# EAGLE design econotag (EAGLE 4.16)

## Sheet 1 of 3
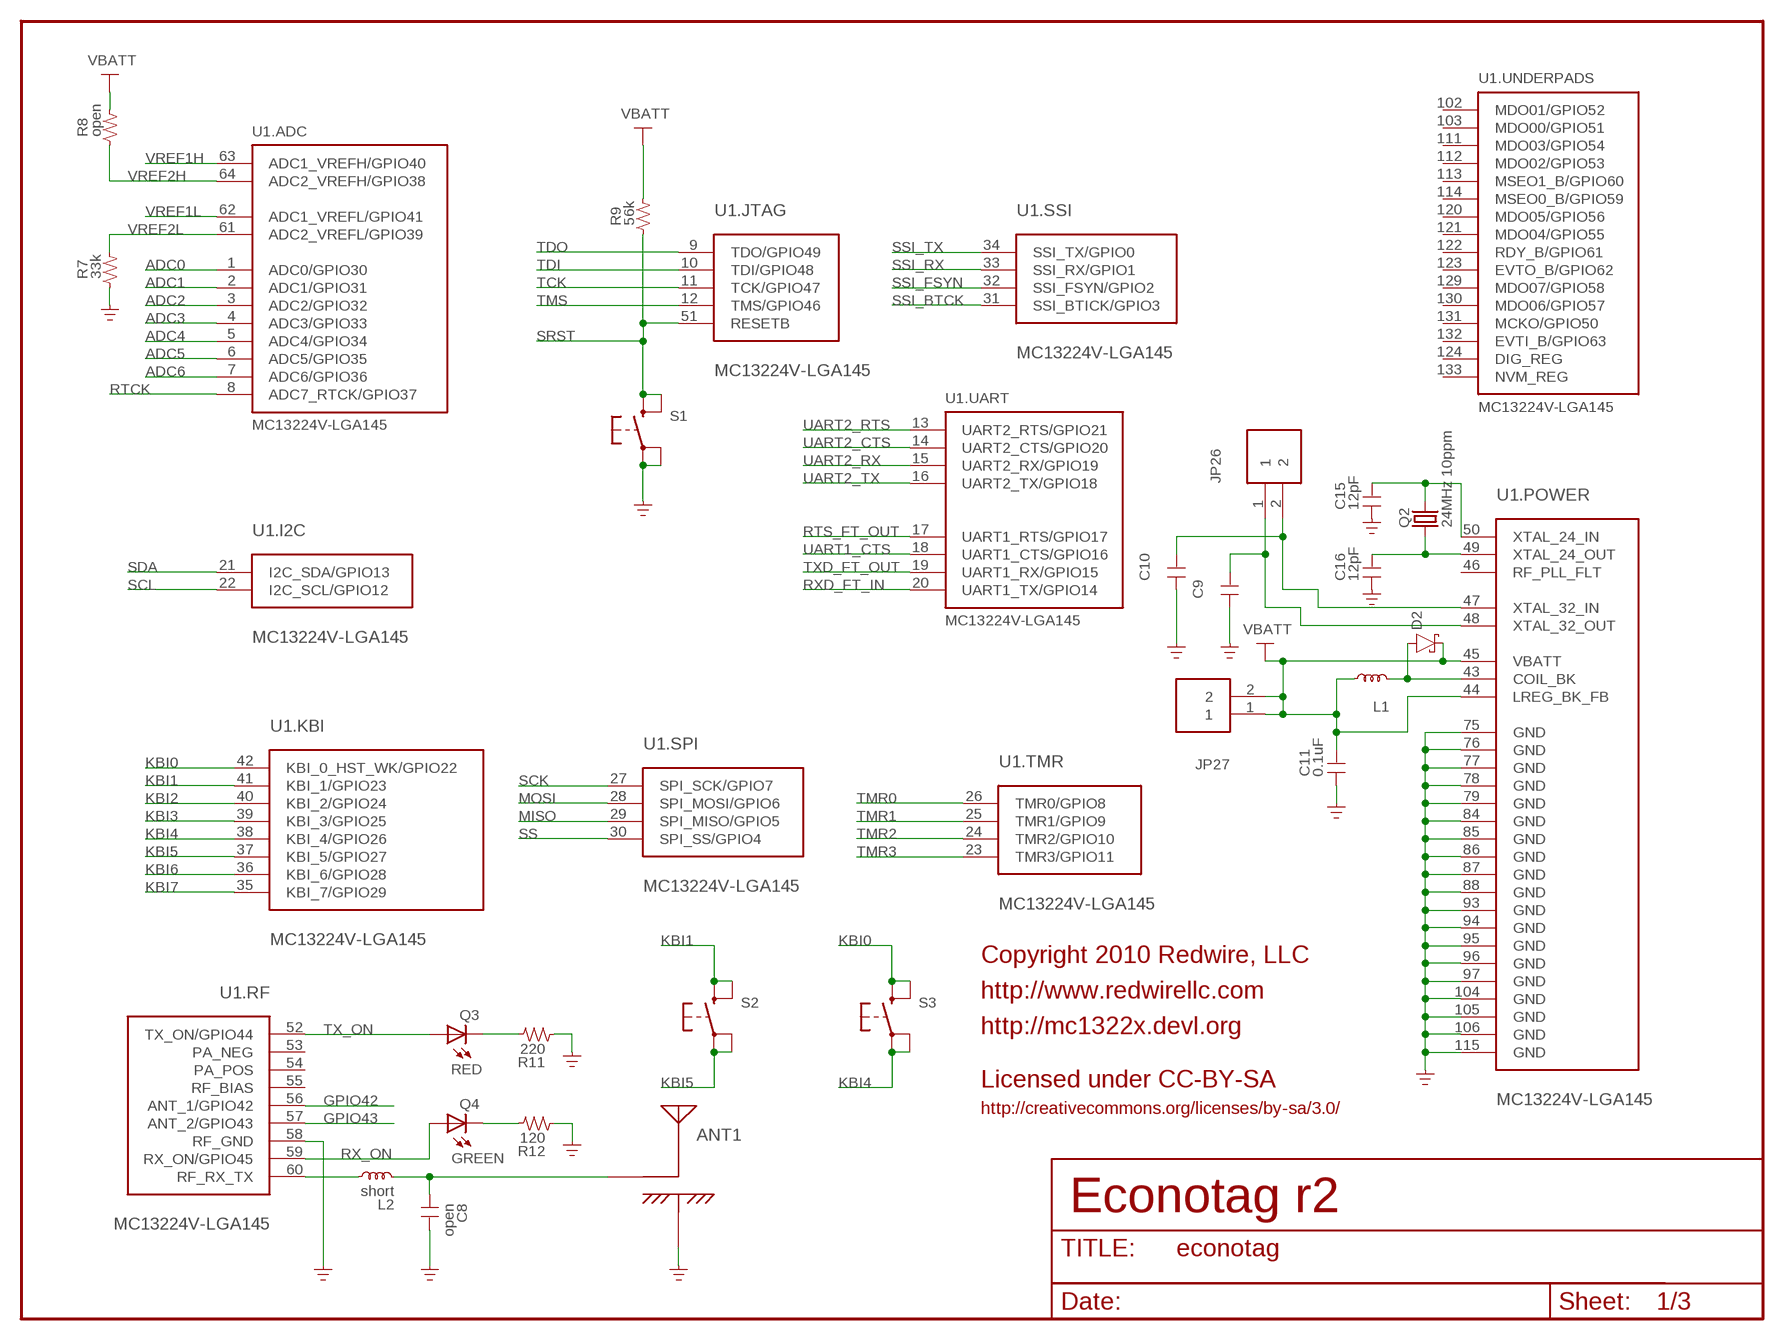
[diagram p0: schematic, sheet 1]

### Parts
ANT1  ANT-2CON  [ANT-INV-F]
C8  open  C-0603  [SMD0603]
C9  C-0603  [SMD0603]
C10  C-0603  [SMD0603]
C11  0.1uF  C-0603  [SMD0603]
C15  12pF  C-0603  [SMD0603]
C16  12pF  C-0603  [SMD0603]
D2  D-SCHOTTKY-SOD123  [SOD123]
JP26  CONN-2  [1X2]
JP27  CONN-2  [1X2]
L1  L-SLF6028  [SLF6028]
L2  short  L-0603  [SMD0603]
Q2  24MHz 10ppm  CRYSTAL  [SM49]
Q3  RED  LED-0603  [LED0603]
Q4  GREEN  LED-0603  [LED0603]
R7  33k  R-0603  [SMD0603]
R8  open  R-0603  [SMD0603]
R9  56k  R-0603  [SMD0603]
R11  220  R-0603  [SMD0603]
R12  120  R-0603  [SMD0603]
S1  SPST-MOM-KSCJ  [KSC-J]
S2  SPST-MOM-KSCJ  [KSC-J]
S3  SPST-MOM-KSCJ  [KSC-J]
U1  MC13224V-LGA145  [LGA145]

### Nets
3V3: C11.2 D2.C JP27.1 JP27.2 L1.1 R8.2 R9.2 U1.44(.POWER:LREG_BK_FB) U1.45(.POWER:VBATT) ; supply symbol labelled VBATT ; also sheet 2,3
ADC0: U1.1(.ADC:ADC0/GPIO30) ; also sheet 3
ADC1: U1.2(.ADC:ADC1/GPIO31) ; also sheet 3
ADC2: U1.3(.ADC:ADC2/GPIO32) ; also sheet 3
ADC3: U1.4(.ADC:ADC3/GPIO33) ; also sheet 3
ADC4: U1.5(.ADC:ADC4/GPIO34) ; also sheet 3
ADC5: U1.6(.ADC:ADC5/GPIO35) ; also sheet 3
ADC6: U1.7(.ADC:ADC6/GPIO36) ; also sheet 3
GND: ANT1.GND C8.2 C9.1 C10.1 C11.1 C15.1 C16.1 R7.1 R11.1 R12.1 S1.A1(P) S1.A2(P1) U1.58(.RF:RF_GND) U1.75(.POWER:GND) U1.76(.POWER:GND) U1.77(.POWER:GND) U1.78(.POWER:GND) U1.79(.POWER:GND) U1.84(.POWER:GND) U1.85(.POWER:GND) U1.86(.POWER:GND) U1.87(.POWER:GND) U1.88(.POWER:GND) U1.93(.POWER:GND) U1.94(.POWER:GND) U1.95(.POWER:GND) U1.96(.POWER:GND) U1.97(.POWER:GND) U1.104(.POWER:GND) U1.105(.POWER:GND) U1.106(.POWER:GND) U1.115(.POWER:GND) ; also sheet 2,3
GPIO42: U1.56(.RF:ANT_1/GPIO42) ; also sheet 3
GPIO43: U1.57(.RF:ANT_2/GPIO43) ; also sheet 3
KBI0: S3.B1(S) S3.B2(S1) U1.42(.KBI:KBI_0_HST_WK/GPIO22)
KBI1: S2.B1(S) S2.B2(S1) U1.41(.KBI:KBI_1/GPIO23)
KBI2: U1.40(.KBI:KBI_2/GPIO24) ; also sheet 3
KBI3: U1.39(.KBI:KBI_3/GPIO25) ; also sheet 3
KBI4: S3.A1(P) S3.A2(P1) U1.38(.KBI:KBI_4/GPIO26)
KBI5: S2.A1(P) S2.A2(P1) U1.37(.KBI:KBI_5/GPIO27)
KBI6: U1.36(.KBI:KBI_6/GPIO28) ; also sheet 3
KBI7: U1.35(.KBI:KBI_7/GPIO29) ; also sheet 3
MISO: U1.29(.SPI:SPI_MISO/GPIO5) ; also sheet 3
MOSI: U1.28(.SPI:SPI_MOSI/GPIO6) ; also sheet 3
N$11: Q4.C R12.2
N$12: L2.1 U1.60(.RF:RF_RX_TX)
N$13: C16.2 Q2.1 U1.49(.POWER:XTAL_24_OUT)
N$14: C15.2 Q2.2 U1.50(.POWER:XTAL_24_IN)
N$15: ANT1.FEED C8.1 L2.2
N$16: C9.2 JP26.1 U1.48(.POWER:XTAL_32_OUT)
N$17: C10.2 JP26.2 U1.47(.POWER:XTAL_32_IN)
N$19: D2.A L1.2 U1.43(.POWER:COIL_BK)
N$20: Q3.C R11.2
RTCK: U1.8(.ADC:ADC7_RTCK/GPIO37) ; also sheet 2
RTS_FT_OUT: U1.17(.UART:UART1_RTS/GPIO17) ; also sheet 2
RX_ON: Q4.A U1.59(.RF:RX_ON/GPIO45) ; also sheet 3
RXD_FT_IN: U1.20(.UART:UART1_TX/GPIO14) ; also sheet 2
SCK: U1.27(.SPI:SPI_SCK/GPIO7) ; also sheet 3
SCL: U1.22(.I2C:I2C_SCL/GPIO12) ; also sheet 3
SDA: U1.21(.I2C:I2C_SDA/GPIO13) ; also sheet 3
SRST: R9.1 S1.B1(S) S1.B2(S1) U1.51(.JTAG:RESETB) ; also sheet 2
SS: U1.30(.SPI:SPI_SS/GPIO4) ; also sheet 3
SSI_BTCK: U1.31(.SSI:SSI_BTICK/GPIO3) ; also sheet 3
SSI_FSYN: U1.32(.SSI:SSI_FSYN/GPIO2) ; also sheet 3
SSI_RX: U1.33(.SSI:SSI_RX/GPIO1) ; also sheet 3
SSI_TX: U1.34(.SSI:SSI_TX/GPIO0) ; also sheet 3
TCK: U1.11(.JTAG:TCK/GPIO47) ; also sheet 2
TDI: U1.10(.JTAG:TDI/GPIO48) ; also sheet 2
TDO: U1.9(.JTAG:TDO/GPIO49) ; also sheet 2
TMR0: U1.26(.TMR:TMR0/GPIO8) ; also sheet 3
TMR1: U1.25(.TMR:TMR1/GPIO9) ; also sheet 3
TMR2: U1.24(.TMR:TMR2/GPIO10) ; also sheet 3
TMR3: U1.23(.TMR:TMR3/GPIO11) ; also sheet 3
TMS: U1.12(.JTAG:TMS/GPIO46) ; also sheet 2
TX_ON: Q3.A U1.52(.RF:TX_ON/GPIO44) ; also sheet 3
TXD_FT_OUT: U1.19(.UART:UART1_RX/GPIO15) ; also sheet 2
UART1_CTS: U1.18(.UART:UART1_CTS/GPIO16) ; also sheet 2,3
UART2_CTS: U1.14(.UART:UART2_CTS/GPIO20) ; also sheet 3
UART2_RTS: U1.13(.UART:UART2_RTS/GPIO21) ; also sheet 3
UART2_RX: U1.15(.UART:UART2_RX/GPIO19) ; also sheet 3
UART2_TX: U1.16(.UART:UART2_TX/GPIO18) ; also sheet 3
VREF1H: U1.63(.ADC:ADC1_VREFH/GPIO40) ; also sheet 3
VREF1L: U1.62(.ADC:ADC1_VREFL/GPIO41) ; also sheet 3
VREF2H: R8.1 U1.64(.ADC:ADC2_VREFH/GPIO38) ; also sheet 2
VREF2L: R7.2 U1.61(.ADC:ADC2_VREFL/GPIO39) ; also sheet 2
Unconnected: U1.46(.POWER:RF_PLL_FLT) U1.53(.RF:PA_NEG) U1.54(.RF:PA_POS) U1.55(.RF:RF_BIAS) U1.102(.UNDERPADS:MDO01/GPIO52) U1.103(.UNDERPADS:MDO00/GPIO51) U1.111(.UNDERPADS:MDO03/GPIO54) U1.112(.UNDERPADS:MDO02/GPIO53) U1.113(.UNDERPADS:MSEO1_B/GPIO60) U1.114(.UNDERPADS:MSEO0_B/GPIO59) U1.120(.UNDERPADS:MDO05/GPIO56) U1.121(.UNDERPADS:MDO04/GPIO55) U1.122(.UNDERPADS:RDY_B/GPIO61) U1.123(.UNDERPADS:EVTO_B/GPIO62) U1.124(.UNDERPADS:DIG_REG) U1.129(.UNDERPADS:MDO07/GPIO58) U1.130(.UNDERPADS:MDO06/GPIO57) U1.131(.UNDERPADS:MCKO/GPIO50) U1.132(.UNDERPADS:EVTI_B/GPIO63) U1.133(.UNDERPADS:NVM_REG)

### Notes on the sheet
- Copyright 2010 Redwire, LLC
- http://www.redwirellc.com
- http://mc1322x.devl.org
- Licensed under CC-BY-SA
- http://creativecommons.org/licenses/by-sa/3.0/
- Econotag r2

## Sheet 2 of 3
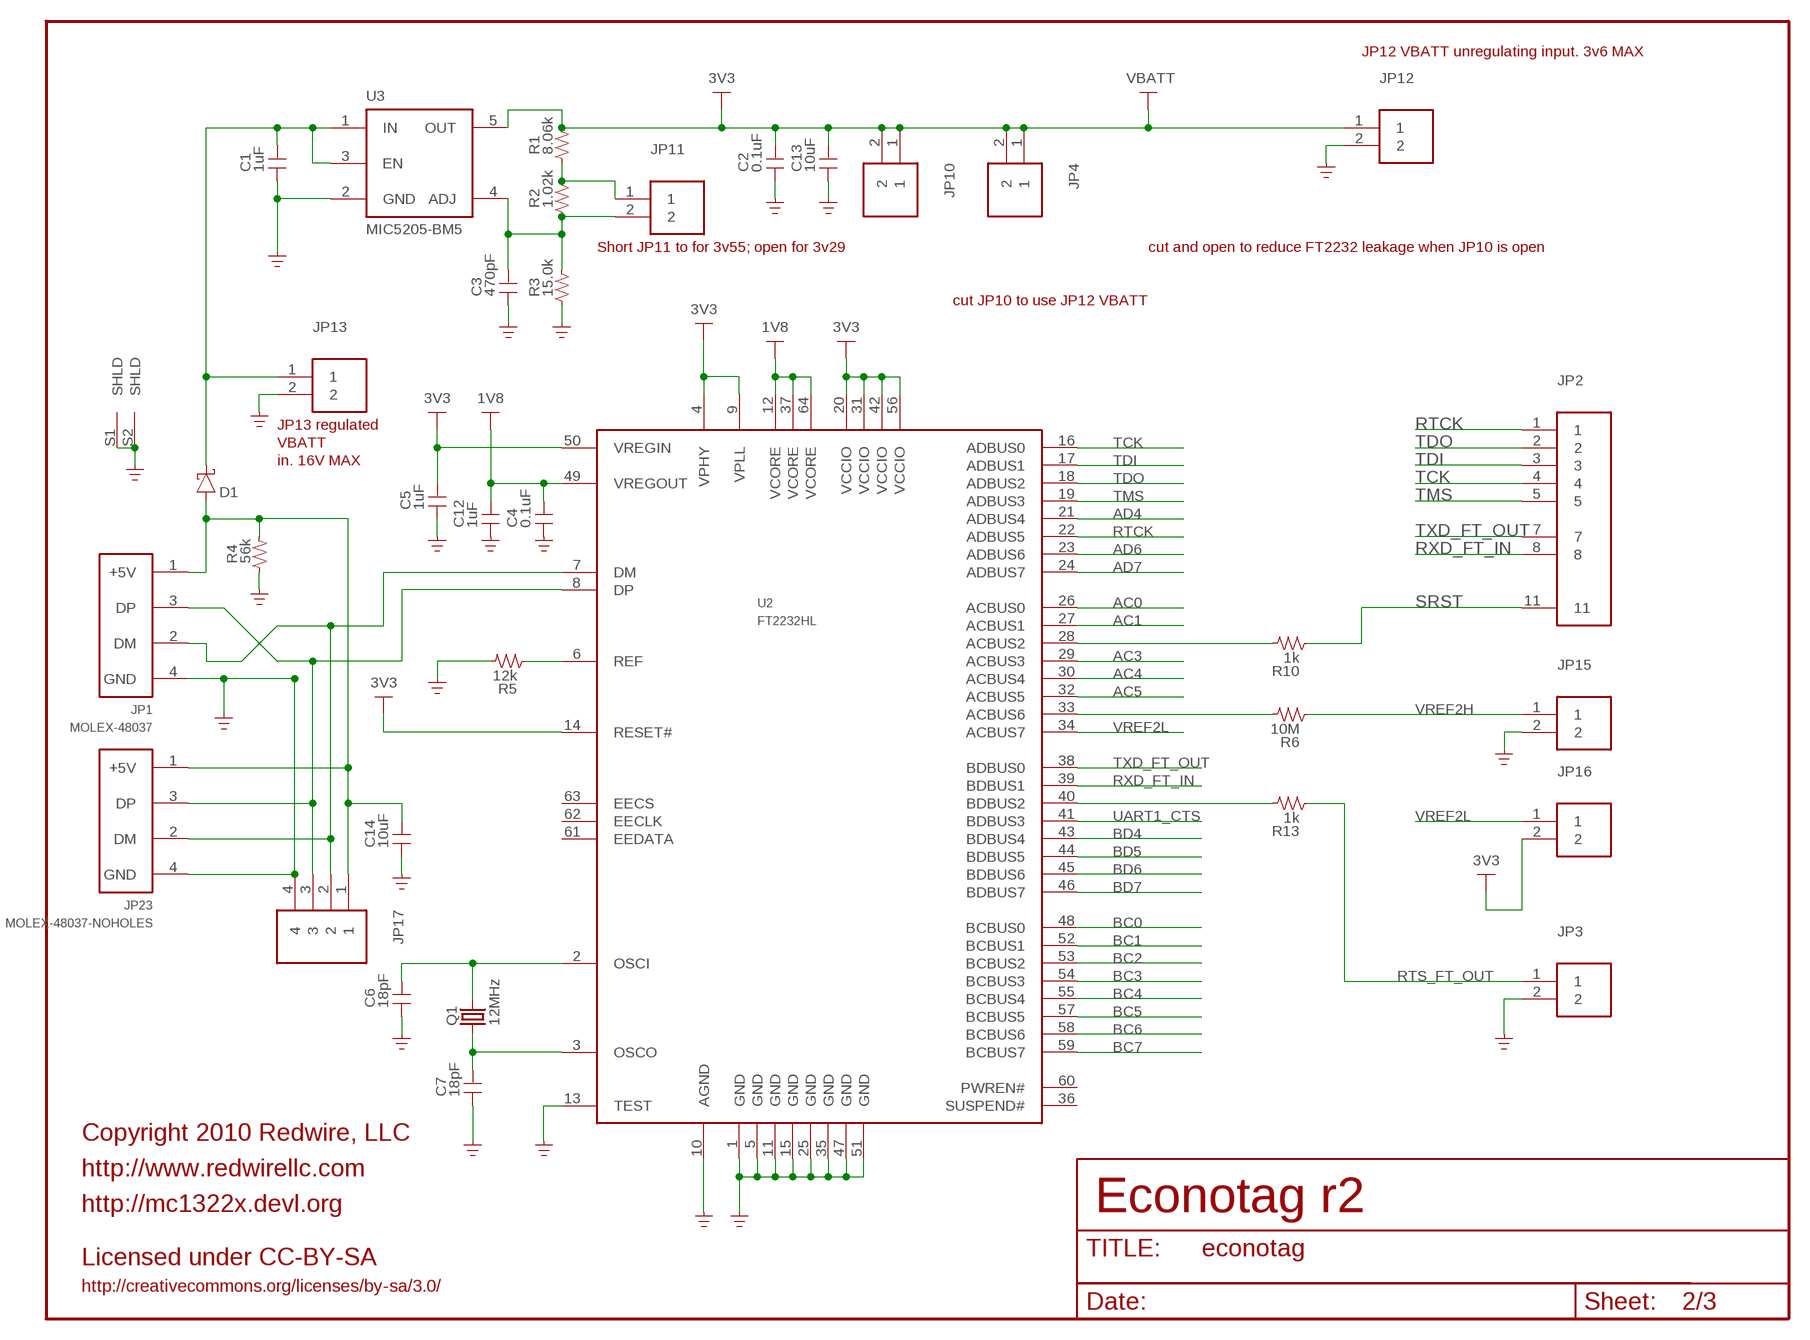
[diagram p1: schematic, sheet 2]

### Parts
C1  1uF  C-0603  [SMD0603]
C2  0.1uF  C-0603  [SMD0603]
C3  470pF  C-0603  [SMD0603]
C4  0.1uF  C-0603  [SMD0603]
C5  1uF  C-0603  [SMD0603]
C6  18pF  C-0603  [SMD0603]
C7  18pF  C-0603  [SMD0603]
C12  1uF  C-0603  [SMD0603]
C13  10uF  C-0805  [SMD0805]
C14  10uF  C-0805  [SMD0805]
D1  D-SCHOTTKY-SOD123  [SOD123]
JP1  MOLEX-48037  [USB-A-PLUG]
JP2  CONN-11  [1X11-SKIP6-9-10]
JP3  CONN-2  [1X2]
JP4  CONN-2  [1X2]
JP10  CONN-2  [1X2]
JP11  CONN-2  [1X2]
JP12  CONN-2  [1X2]
JP13  CONN-2  [1X2]
JP15  CONN-2  [1X2]
JP16  CONN-2  [1X2]
JP17  CONN-4  [1X4]
JP23  MOLEX-48037-NOHOLES  [USB-A-PLUG-NOHOLES]
Q1  12MHz  CRYSTAL  [SM49]
R1  8.06k  R-0603  [SMD0603]
R2  1.02k  R-0603  [SMD0603]
R3  15.0k  R-0603  [SMD0603]
R4  56k  R-0603  [SMD0603]
R5  12k  R-0603  [SMD0603]
R6  10M  R-0603  [SMD0603]
R10  1k  R-0603  [SMD0603]
R13  1k  R-0603  [SMD0603]
U2  FT2232HL  [LQFP-64]
U3  MIC5205-BM5  [SOT-23-5]

### Nets
1V8: C4.2 C12.2 U2.12(VCORE) U2.37(VCORE) U2.49(VREGOUT) U2.64(VCORE)
3V3: C2.2 C5.2 C13.2 JP4.1 JP4.2 JP10.1 JP10.2 JP12.1 JP16.2 R1.2 U2.4(VPHY) U2.9(VPLL) U2.14(RESET#) U2.20(VCCIO) U2.31(VCCIO) U2.42(VCCIO) U2.50(VREGIN) U2.56(VCCIO) U3.5(OUT) ; supply symbol labelled VBATT ; also sheet 1,3
+5V: C14.2 D1.A JP1.1(+5V) JP17.1 JP23.1(+5V) R4.2
AC0: U2.26(ACBUS0)
AC1: U2.27(ACBUS1)
AC3: U2.29(ACBUS3)
AC4: U2.30(ACBUS4)
AC5: U2.32(ACBUS5)
AD4: U2.21(ADBUS4)
AD6: U2.23(ADBUS6)
AD7: U2.24(ADBUS7)
BC0: U2.48(BCBUS0)
BC1: U2.52(BCBUS1)
BC2: U2.53(BCBUS2)
BC3: U2.54(BCBUS3)
BC4: U2.55(BCBUS4)
BC5: U2.57(BCBUS5)
BC6: U2.58(BCBUS6)
BC7: U2.59(BCBUS7)
BD4: U2.43(BDBUS4)
BD5: U2.44(BDBUS5)
BD6: U2.45(BDBUS6)
BD7: U2.46(BDBUS7)
GND: C1.1 C2.1 C3.1 C4.1 C5.1 C6.1 C7.1 C12.1 C13.1 C14.1 JP1.4(GND) JP1.S1(SHLD) JP1.S2(SHLD) JP3.2 JP12.2 JP13.2 JP15.2 JP17.4 JP23.4(GND) R3.1 R4.1 R5.2 U2.1(GND) U2.5(GND) U2.10(AGND) U2.11(GND) U2.13(TEST) U2.15(GND) U2.25(GND) U2.35(GND) U2.47(GND) U2.51(GND) U3.2(GND) ; also sheet 1,3
N$1: C1.2 D1.C JP13.1 U3.1(IN) U3.3(EN)
N$2: JP11.1 R1.1 R2.2
N$3: C3.2 JP11.2 R2.1 R3.2 U3.4(ADJ)
N$4: R5.1 U2.6(REF)
N$5: C6.2 Q1.2 U2.2(OSCI)
N$6: R6.2 U2.33(ACBUS6)
N$7: C7.2 Q1.1 U2.3(OSCO)
N$8: JP1.3(DP) JP17.3 JP23.3(DP) U2.8(DP)
N$9: JP1.2(DM) JP17.2 JP23.2(DM) U2.7(DM)
N$10: R10.2 U2.28(ACBUS2)
N$18: R13.2 U2.40(BDBUS2)
RTCK: JP2.1 U2.22(ADBUS5) ; also sheet 1
RTS_FT_OUT: JP3.1 R13.1 ; also sheet 1
RXD_FT_IN: JP2.8 U2.39(BDBUS1) ; also sheet 1
SRST: JP2.11 R10.1 ; also sheet 1
TCK: JP2.4 U2.16(ADBUS0) ; also sheet 1
TDI: JP2.3 U2.17(ADBUS1) ; also sheet 1
TDO: JP2.2 U2.18(ADBUS2) ; also sheet 1
TMS: JP2.5 U2.19(ADBUS3) ; also sheet 1
TXD_FT_OUT: JP2.7 U2.38(BDBUS0) ; also sheet 1
UART1_CTS: U2.41(BDBUS3) ; also sheet 1,3
VREF2H: JP15.1 R6.1 ; also sheet 1
VREF2L: JP16.1 U2.34(ACBUS7) ; also sheet 1
Unconnected: U2.36(SUSPEND#) U2.60(PWREN#) U2.61(EEDATA) U2.62(EECLK) U2.63(EECS)

### Notes on the sheet
- JP12 VBATT unregulating input. 3v6 MAX
- Short JP11 to for 3v55; open for 3v29 | cut and open to reduce FT2232 leakage when JP10 is open
- cut JP10 to use JP12 VBATT
- JP13 regulated
- VBATT
- in. 16V MAX
- Copyright 2010 Redwire, LLC
- http://www.redwirellc.com
- http://mc1322x.devl.org | Econotag r2
- Licensed under CC-BY-SA
- http://creativecommons.org/licenses/by-sa/3.0/

## Sheet 3 of 3
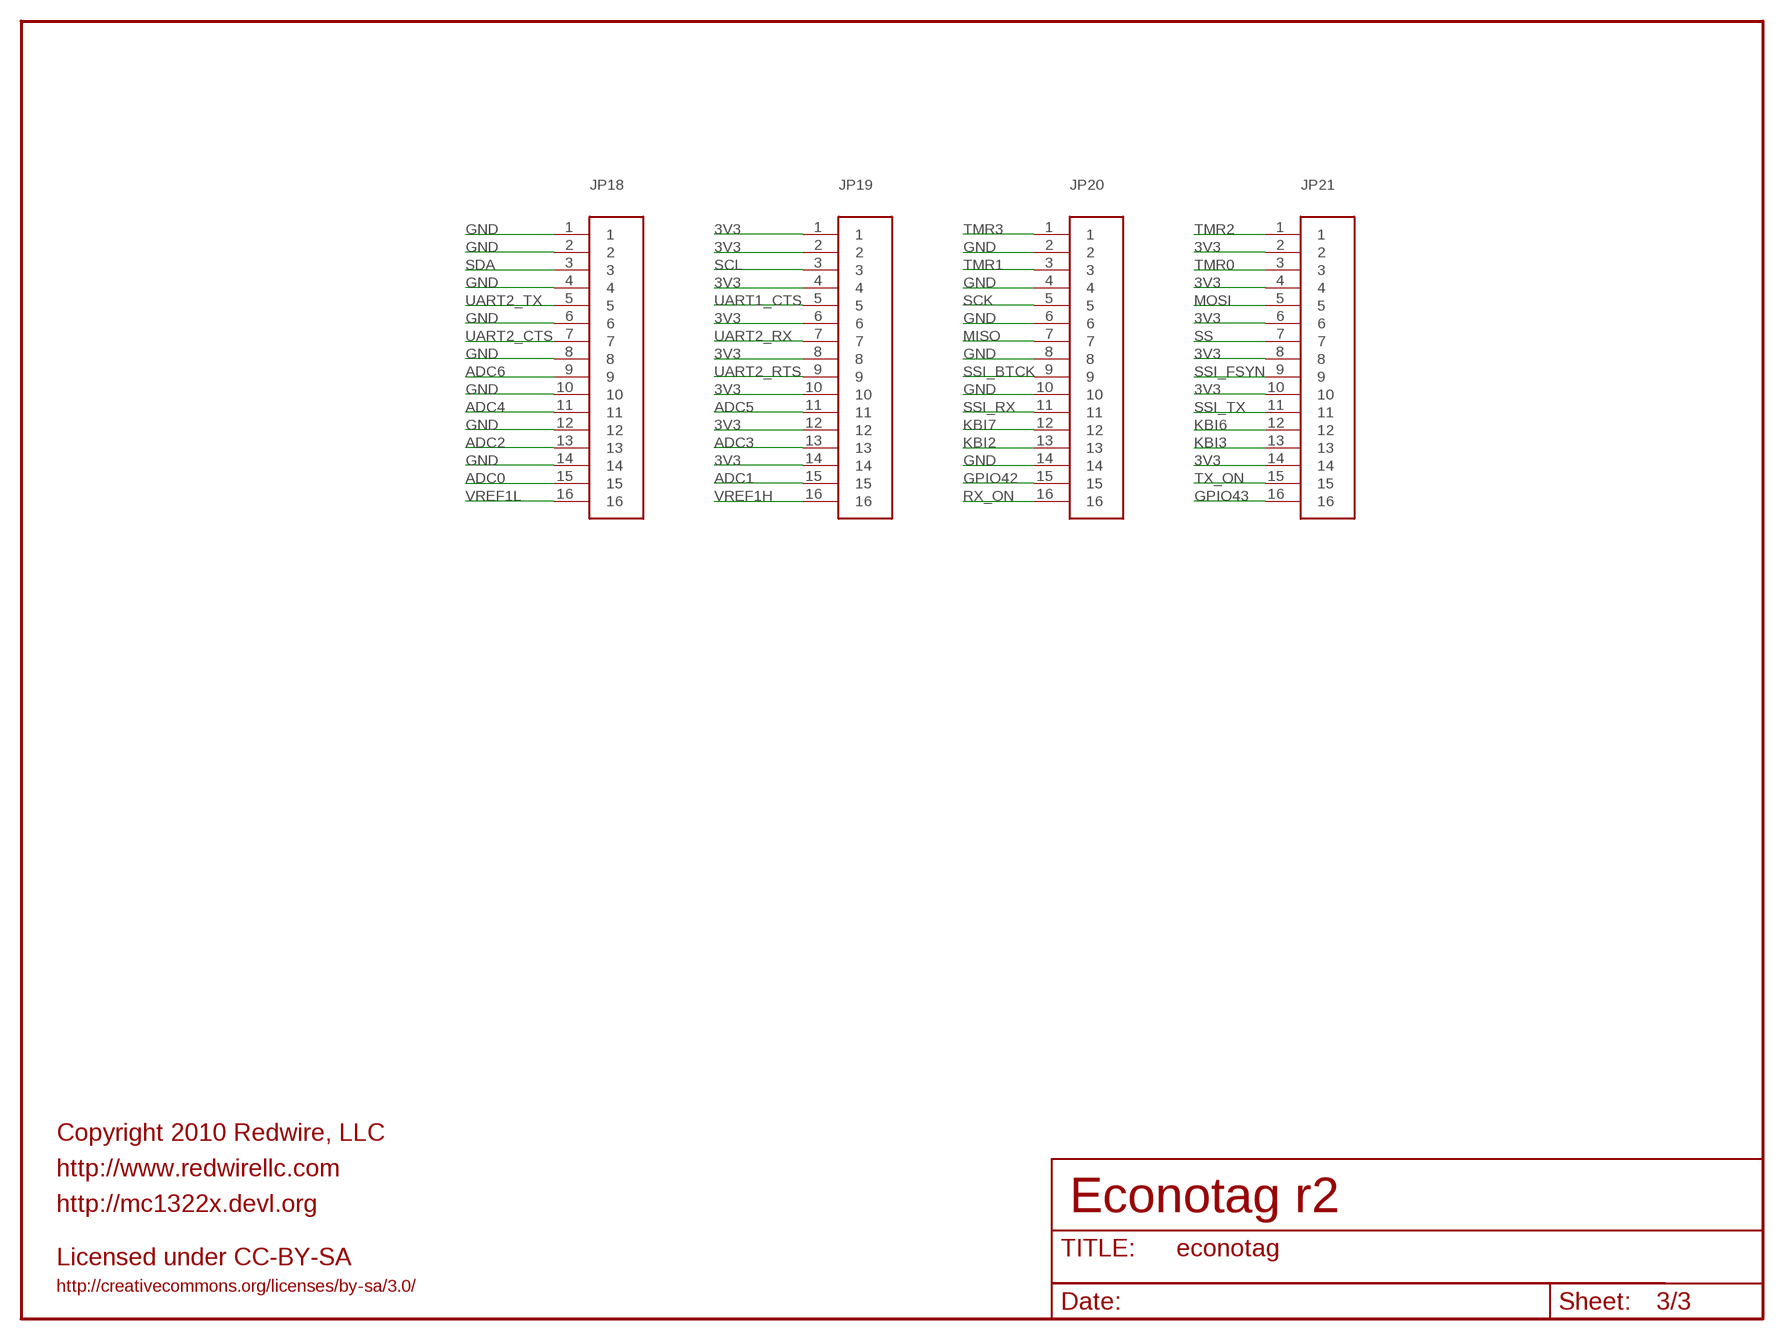
[diagram p2: schematic, sheet 3]

### Parts
JP18  CONN-16  [1X16]
JP19  CONN-16  [1X16]
JP20  CONN-16  [1X16]
JP21  CONN-16  [1X16]

### Nets
3V3: JP19.1 JP19.2 JP19.4 JP19.6 JP19.8 JP19.10 JP19.12 JP19.14 JP21.2 JP21.4 JP21.6 JP21.8 JP21.10 JP21.14 ; also sheet 1,2
ADC0: JP18.15 ; also sheet 1
ADC1: JP19.15 ; also sheet 1
ADC2: JP18.13 ; also sheet 1
ADC3: JP19.13 ; also sheet 1
ADC4: JP18.11 ; also sheet 1
ADC5: JP19.11 ; also sheet 1
ADC6: JP18.9 ; also sheet 1
GND: JP18.1 JP18.2 JP18.4 JP18.6 JP18.8 JP18.10 JP18.12 JP18.14 JP20.2 JP20.4 JP20.6 JP20.8 JP20.10 JP20.14 ; also sheet 1,2
GPIO42: JP20.15 ; also sheet 1
GPIO43: JP21.16 ; also sheet 1
KBI2: JP20.13 ; also sheet 1
KBI3: JP21.13 ; also sheet 1
KBI6: JP21.12 ; also sheet 1
KBI7: JP20.12 ; also sheet 1
MISO: JP20.7 ; also sheet 1
MOSI: JP21.5 ; also sheet 1
RX_ON: JP20.16 ; also sheet 1
SCK: JP20.5 ; also sheet 1
SCL: JP19.3 ; also sheet 1
SDA: JP18.3 ; also sheet 1
SS: JP21.7 ; also sheet 1
SSI_BTCK: JP20.9 ; also sheet 1
SSI_FSYN: JP21.9 ; also sheet 1
SSI_RX: JP20.11 ; also sheet 1
SSI_TX: JP21.11 ; also sheet 1
TMR0: JP21.3 ; also sheet 1
TMR1: JP20.3 ; also sheet 1
TMR2: JP21.1 ; also sheet 1
TMR3: JP20.1 ; also sheet 1
TX_ON: JP21.15 ; also sheet 1
UART1_CTS: JP19.5 ; also sheet 1,2
UART2_CTS: JP18.7 ; also sheet 1
UART2_RTS: JP19.9 ; also sheet 1
UART2_RX: JP19.7 ; also sheet 1
UART2_TX: JP18.5 ; also sheet 1
VREF1H: JP19.16 ; also sheet 1
VREF1L: JP18.16 ; also sheet 1

### Notes on the sheet
- Copyright 2010 Redwire, LLC
- http://www.redwirellc.com
- http://mc1322x.devl.org | Econotag r2
- Licensed under CC-BY-SA
- http://creativecommons.org/licenses/by-sa/3.0/

## Library data of the parts
ANT1 = parts:ANT-2CON
C1-C16 = parts:C
D1 D2 = parts:D-SCHOTTKY
JP1 = parts:MOLEX-48037
JP2 = parts:CONN-11
JP3 JP4 JP10-JP13 JP15 JP16 JP26 JP27 = parts:CONN-2
JP17 = parts:CONN-4
JP18-JP21 = parts:CONN-16
JP23 = parts:MOLEX-48037-NOHOLES
L1 L2 = parts:L: TDK SLF6028 Series From mouser: 810-SLF6028T-101M, 100uH, .42A, $2.73 From digikey: 445-1990-1-ND, 100uH, .42A, $2.73
Q1 Q2 = parts:CRYSTAL: 12MHz 5032 Digikey = 535-9100-1-ND
Q3 Q4 = parts:LED
R1-R13 = parts:R
S1-S3 = parts:SPST-MOM: Tact. Switch
U1 = parts:MC1322*
U2 = parts:FT2232H
U3 = parts:MIC5205*

## Board
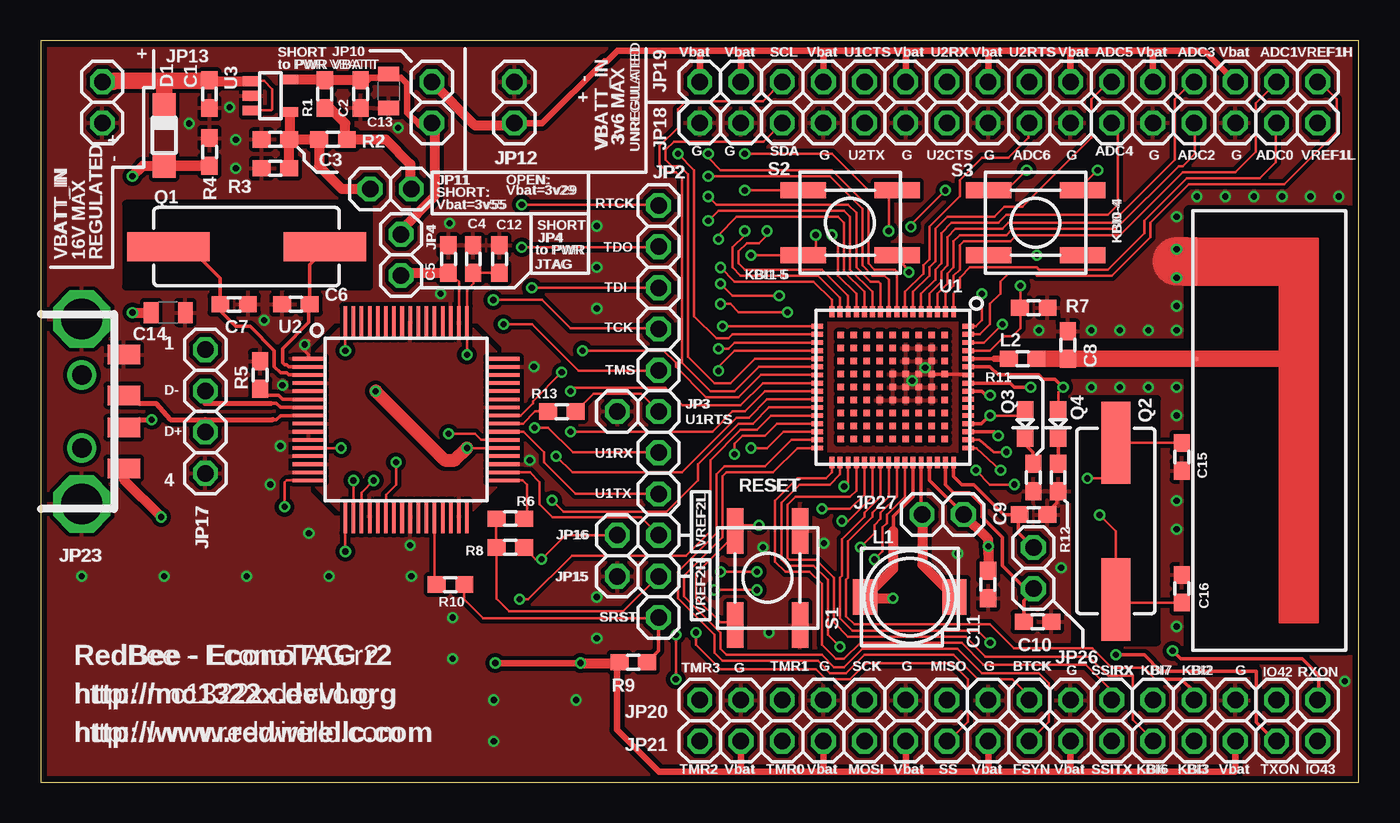
[diagram p3: board, top side]
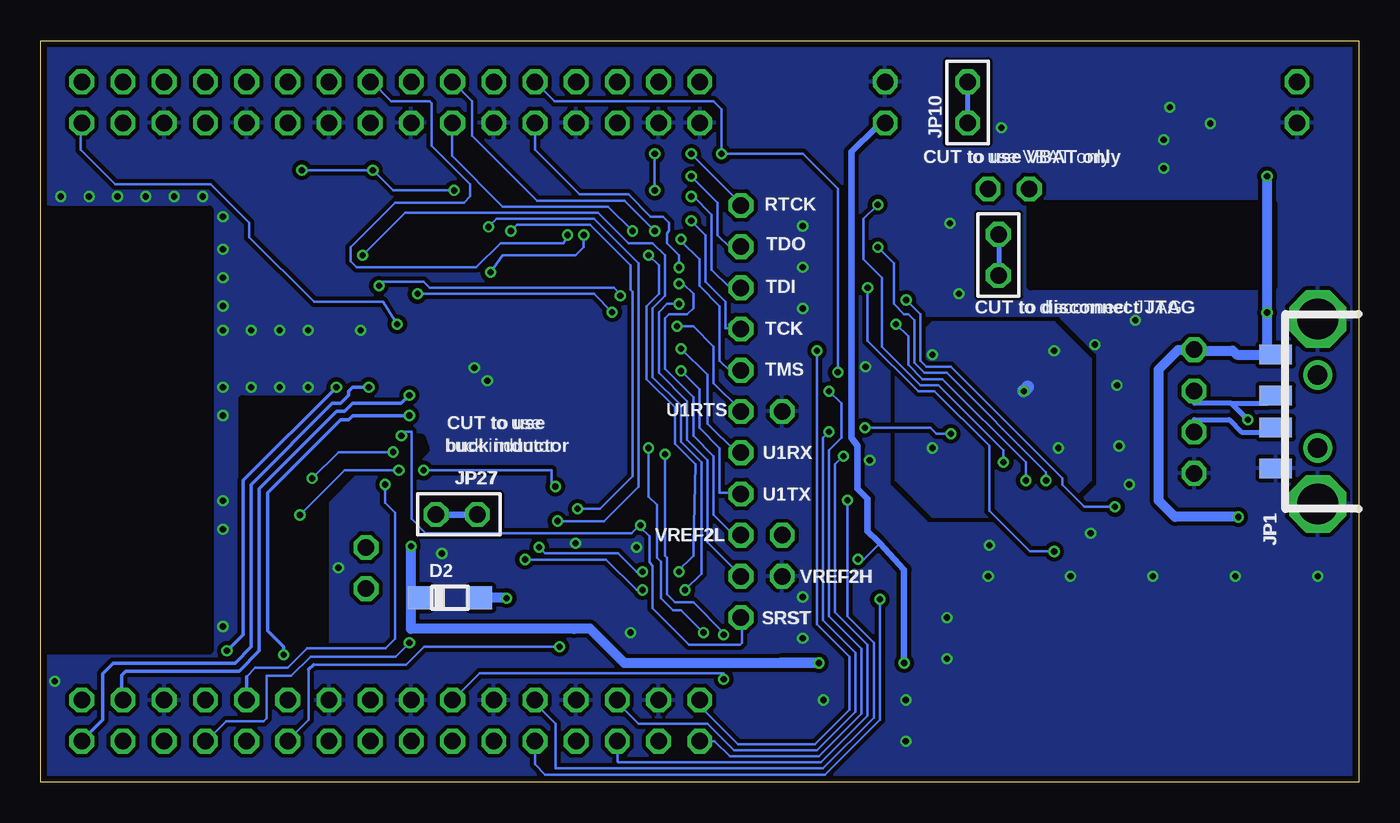
[diagram p4: board, bottom side, seen from below]

Size 81.28 x 45.72 mm. Coordinates in mm from the lower left corner, seen from the top.
Outline: 0,0 81.28,0 81.28,45.72 0,45.72 0,0
Copper layers (1*16): Top 0.0356mm / dielectric 1.5011mm / Bottom 0.0356mm
Design rules "33each": minimum track width 6mil, minimum drill 15mil, track to track 6mil, track to pad 6mil, pad to pad 6mil, via to via 6mil, smd to smd 6mil, copper to edge 15mil, drill to drill 10mil, minimum pad ring 10mil, minimum via ring 6mil, stop-mask expansion 2mil, vias tented up to drill 0mil, thermal gap 10mil
tRestrict: area 63.8,8.6 to 68.8,23.6; area 57.8,25.1 to 70.8,27.1; area 5.3,30.6 to 20.3,35.7; area 80.3,8.1 to 81,35.3
bRestrict: area 63.8,8.6 to 68.8,23.6; area 57.6,17.5 to 63.9,21.2; area 5.3,30.6 to 20.3,35.7; area 70.9,8.1 to 80.8,35.3; area 22.9,39.4 to 25.4,44.5; area 53,15.2 to 58,17.8; area 21,30 to 23.5,35

### Footprints (pad centres in the part's own frame; a part is rotated, then mirrored left to right if it is on the bottom)
ANT-INV-F = smd 0.203 x 0.203: FEED -6.706,-0.457 | smd 0.203 x 2.997: GND -6.756,5.537
SMD0603 = smd 1.1 x 1: 1 -0.85,0; 2 0.85,0
SMD0805 = smd 0.9 x 1.3: 1 -1.05,0; 2 1.05,0
SOD123 = smd 1.4 x 1.4: A 1.9,0; C -1.9,0
USB-A-PLUG = smd 1.2 x 2: 1 3.5,2.6; 2 1,2.6; 3 -1,2.6; 4 -3.5,2.6 | drill 1.2 pad 1.21 round: H1 -2.25,0; H2 2.25,0 | drill 2.5 octagon: S1 -5.7,0; S2 5.7,0
1X11-SKIP6-9-10 = drill 1.016 octagon: 1 0,0; 2 0,-2.54; 3 0,-5.08; 4 0,-7.62; 5 0,-10.16; 7 0,-15.24; 8 0,-17.78; 11 0,-25.4
1X2 = drill 1.016 octagon: 1 0,0; 2 0,-2.54
1X4 = drill 1.016 octagon: 1 0,0; 2 0,-2.54; 3 0,-5.08; 4 0,-7.62
1X16 = drill 1.016 octagon: 1 0,0; 2 0,-2.54; 3 0,-5.08; 4 0,-7.62; 5 0,-10.16; 6 0,-12.7; 7 0,-15.24; 8 0,-17.78; 9 0,-20.32; 10 0,-22.86; 11 0,-25.4; 12 0,-27.94; 13 0,-30.48; 14 0,-33.02; 15 0,-35.56; 16 0,-38.1
USB-A-PLUG-NOHOLES = smd 1.2 x 2: 1 3.5,2.6; 2 1,2.6; 3 -1,2.6; 4 -3.5,2.6
SLF6028 = smd 2.2 x 1.5: 1 0,2.75; 2 0,-2.75
SM49 = smd 5.08 x 1.778: 1 -4.826,0; 2 4.826,0
LED0603 = smd 1.1 x 1: A -0.85,0; C 0.85,0
KSC-J = smd 2.8 x 1: A1 -2.9,2; A2 2.9,2; B1 -2.9,-2; B2 2.9,-2
LGA145 = smd 0.7 x 0.3: 1 -4.65,3.75; 2 -4.65,3.25; 3 -4.65,2.75; 4 -4.65,2.25; 5 -4.65,1.75; 6 -4.65,1.25; 7 -4.65,0.75; 8 -4.65,0.25; 9 -4.65,-0.25; 10 -4.65,-0.75; 11 -4.65,-1.25; 12 -4.65,-1.75; 13 -4.65,-2.25; 14 -4.65,-2.75; 15 -4.65,-3.25; 16 -4.65,-3.75; 33 4.65,-3.75; 34 4.65,-3.25; 35 4.65,-2.75; 36 4.65,-2.25; 37 4.65,-1.75; 38 4.65,-1.25; 39 4.65,-0.75; 40 4.65,-0.25; 41 4.65,0.25; 42 4.65,0.75; 43 4.65,1.25; 44 4.65,1.75; 45 4.65,2.25; 46 4.65,2.75; 47 4.65,3.25; 48 4.65,3.75 | smd 0.3 x 0.7: 17 -3.75,-4.65; 18 -3.25,-4.65; 19 -2.75,-4.65; 20 -2.25,-4.65; 21 -1.75,-4.65; 22 -1.25,-4.65; 23 -0.75,-4.65; 24 -0.25,-4.65; 25 0.25,-4.65; 26 0.75,-4.65; 27 1.25,-4.65; 28 1.75,-4.65; 29 2.25,-4.65; 30 2.75,-4.65; 31 3.25,-4.65; 32 3.75,-4.65; 49 3.75,4.65; 50 3.25,4.65; 51 2.75,4.65; 52 2.25,4.65; 53 1.75,4.65; 54 1.25,4.65; 55 0.75,4.65; 56 0.25,4.65; 57 -0.25,4.65; 58 -0.75,4.65; 59 -1.25,4.65; 60 -1.75,4.65; 61 -2.25,4.65; 62 -2.75,4.65; 63 -3.25,4.65; 64 -3.75,4.65 | smd 0.4 x 0.4: 65 -3.2,3.2; 66 -2.4,3.2; 67 -1.6,3.2; 68 -0.8,3.2; 69 0,3.2; 70 0.8,3.2; 71 1.6,3.2; 72 2.4,3.2; 73 3.2,3.2; 74 -3.2,2.4; 75 -2.4,2.4; 76 -1.6,2.4; 77 -0.8,2.4; 78 0,2.4; 79 0.8,2.4; 80 1.6,2.4; 81 2.4,2.4; 82 3.2,2.4; 83 -3.2,1.6; 84 -2.4,1.6; 85 -1.6,1.6; 86 -0.8,1.6; 87 0,1.6; 88 0.8,1.6; 89 1.6,1.6; 90 2.4,1.6; 91 3.2,1.6; 92 -3.2,0.8; 93 -2.4,0.8; 94 -1.6,0.8; 95 -0.8,0.8; 96 0,0.8; 97 0.8,0.8; 98 1.6,0.8; 99 2.4,0.8; 100 3.2,0.8; 101 -3.2,0; 102 -2.4,0; 103 -1.6,0; 104 -0.8,0; 105 0,0; 106 0.8,0; 107 1.6,0; 108 2.4,0; 109 3.2,0; 110 -3.2,-0.8; 111 -2.4,-0.8; 112 -1.6,-0.8; 113 -0.8,-0.8; 114 0,-0.8; 115 0.8,-0.8; 116 1.6,-0.8; 117 2.4,-0.8; 118 3.2,-0.8; 119 -3.2,-1.6; 120 -2.4,-1.6; 121 -1.6,-1.6; 122 -0.8,-1.6; 123 0,-1.6; 124 0.8,-1.6; 125 1.6,-1.6; 126 2.4,-1.6; 127 3.2,-1.6; 128 -3.2,-2.4; 129 -2.4,-2.4; 130 -1.6,-2.4; 131 -0.8,-2.4; 132 0,-2.4; 133 0.8,-2.4; 134 1.6,-2.4; 135 2.4,-2.4; 136 3.2,-2.4; 137 -3.2,-3.2; 138 -2.4,-3.2; 139 -1.6,-3.2; 140 -0.8,-3.2; 141 0,-3.2; 142 0.8,-3.2; 143 1.6,-3.2; 144 2.4,-3.2; 145 3.2,-3.2
LQFP-64 = smd 2 x 0.22: 1 -6,3.75; 2 -6,3.25; 3 -6,2.75; 4 -6,2.25; 5 -6,1.75; 6 -6,1.25; 7 -6,0.75; 8 -6,0.25; 9 -6,-0.25; 10 -6,-0.75; 11 -6,-1.25; 12 -6,-1.75; 13 -6,-2.25; 14 -6,-2.75; 15 -6,-3.25; 16 -6,-3.75; 33 6,-3.75; 34 6,-3.25; 35 6,-2.75; 36 6,-2.25; 37 6,-1.75; 38 6,-1.25; 39 6,-0.75; 40 6,-0.25; 41 6,0.25; 42 6,0.75; 43 6,1.25; 44 6,1.75; 45 6,2.25; 46 6,2.75; 47 6,3.25; 48 6,3.75 | smd 0.22 x 2: 17 -3.75,-6; 18 -3.25,-6; 19 -2.75,-6; 20 -2.25,-6; 21 -1.75,-6; 22 -1.25,-6; 23 -0.75,-6; 24 -0.25,-6; 25 0.25,-6; 26 0.75,-6; 27 1.25,-6; 28 1.75,-6; 29 2.25,-6; 30 2.75,-6; 31 3.25,-6; 32 3.75,-6; 49 3.75,6; 50 3.25,6; 51 2.75,6; 52 2.25,6; 53 1.75,6; 54 1.25,6; 55 0.75,6; 56 0.25,6; 57 -0.25,6; 58 -0.75,6; 59 -1.25,6; 60 -1.75,6; 61 -2.25,6; 62 -2.75,6; 63 -3.25,6; 64 -3.75,6
SOT-23-5 = smd 0.6 x 1: 1 0.9,1.3; 2 0,1.3; 3 -0.9,1.3; 4 -1,-1.1; 5 1,-1.1

### Placement (x,y rotation side)
ANT1  77.94,26.56 0 top
C1  10.41,42.42 90 top
C2  19.74,42.42 90 top
C3  14.48,39.62 0 top
C4  26.67,32.26 270 top
C5  25.15,32.26 270 top
C6  15.75,29.46 0 top
C7  11.94,29.46 180 top
C8  63.34,26.96 90 top
C9  61.21,16.51 180 top
C10  61.47,9.91 180 top
C11  58.42,12.19 90 top
C12  28.29,32.26 270 top
C13  21.46,42.61 90 top
C14  7.87,28.96 180 top
C15  70.36,20.07 90 top
C16  70.36,11.94 270 top
D1  7.62,39.88 270 top
D2  56.04,11.38 0 bottom
JP1  2.54,22.86 90 bottom
JP2  38.1,35.56 0 top
JP3  38.1,22.86 270 top
JP4  22.22,33.78 0 top
JP10  24.13,43.18 0 top
JP11  22.86,36.58 270 top
JP12  29.21,40.64 180 top
JP13  3.81,43.18 0 top
JP15  38.1,12.7 270 top
JP16  38.1,15.24 270 top
JP17  10.16,26.67 0 top
JP18  40.64,40.64 90 top
JP19  40.64,43.18 90 top
JP20  40.64,5.08 90 top
JP21  40.64,2.54 90 top
JP23  2.54,22.86 270 top
JP26  61.21,14.48 0 top
JP27  54.36,16.51 90 top
L1  53.59,11.43 270 top
L2  60.54,26.11 0 top
Q1  12.7,33.02 0 top
Q2  66.29,16.11 90 top
Q3  60.71,22.1 270 top
Q4  62.74,22.1 270 top
R1  17.53,42.42 90 top
R2  18.03,39.62 0 top
R3  14.48,37.85 0 top
R4  10.41,38.86 270 top
R5  13.54,25.11 90 top
R6  28.96,16.26 0 top
R7  61.24,29.26 180 top
R8  28.96,14.48 0 top
R9  36.54,7.41 180 top
R10  25.27,12.19 180 top
R11  61.21,18.8 90 top
R12  62.74,18.8 90 top
R13  32.13,22.86 180 top
S1  44.83,12.6 270 top
S2  49.91,34.49 0 top
S3  61.34,34.49 0 top
U1  52.54,24.36 270 top
U2  22.54,22.36 0 top
U3  14.27,42.32 90 top

### Tracks (layer width: path | path; a pad name or v marks a point on that pad's centre or on a via)
1V8  (via drill 0.38)
  Top 0.152: U2.12 v18.54,20.61 | v18.79,26.61 U2.64 | v26.29,26.36 U2.49 26.29,30.36 26.69,30.76 26.69,31.36 26.67,31.38 C4.2 28.24,31.41 28.26,31.43 C12.2 | v26.29,20.61 U2.37
  Top 0.813: v26.29,20.61 25.54,19.86 24.91,19.86 v20.66,24.11
  Bottom 0.152: v18.54,20.61 18.79,20.61 | v18.79,26.61 18.79,26.36 | v26.29,20.61 26.04,20.61
  Bottom 0.813: v20.66,24.11 20.41,24.36
  pour Bottom (isolate 0.254): 16.54,18.61 16.54,26.11 18.79,28.36 26.29,28.36 28.54,26.11 28.54,18.61 26.29,16.36 18.79,16.36
3V3  (via drill 0.38)
  Top 0.152: C5.2 25.58,31.15 25.54,31.11 25.79,30.86 U2.50 | JP12.1 29.26,40.64 | 29.21,40.53 29.21,40.39 | 29.21,40.53 29.24,40.56 | 29.21,40.53 29.14,40.46 | 29.24,40.56 29.34,40.46 29.14,40.26 29.14,40.46 | 29.24,40.56 29.14,40.46 | 29.24,40.56 29.24,40.66 29.14,40.66 29.14,40.56 | R8.2 30.52,13.76 v30.89,13.76 32.37,15.23 JP16.2 | U2.20 20.29,16.38
  Top 0.203: JP27.1 54.33,16.51 54.33,16.57 54.29,16.61 U1.44 | JP27.2 56.95,16.51 54.79,18.61 U1.45 | 58.42,14.11 58.54,14.11 | JP10.2 24.16,40.64 24.19,40.61
  Top 0.406: JP19.14 71.76,45.09 68.58,45.09 | 48.26,45.09 53.34,45.09 | 53.34,45.09 58.42,45.09 | 58.42,45.09 63.5,45.09 | 63.5,45.09 68.58,45.09 | 48.26,45.09 JP19.4 | 53.34,45.09 JP19.6 | 58.42,45.09 JP19.8 | 68.58,45.09 JP19.12 | 63.5,45.09 JP19.10 | 40.64,45.09 35.56,45.09 34.92,44.45 34.76,44.45 30.91,40.61 29.29,40.61 29.26,40.64 | 40.64,45.09 43.18,45.09 | 43.18,45.09 48.26,45.09 | 43.18,45.09 JP19.2 | 40.64,45.09 JP19.1 | JP21.14 73.66,0.68 73.64,0.66 63.44,0.66 | 43.14,0.66 38.14,0.66 35.54,3.26 35.54,7.36 35.64,7.36 R9.2 | 43.14,0.66 48.24,0.66 | 48.24,0.66 53.34,0.66 | 53.34,0.66 58.34,0.66 | 58.34,0.66 63.44,0.66 | 63.44,0.66 63.44,0.76 63.5,0.82 JP21.10 | 58.34,0.66 58.44,0.76 58.42,0.84 JP21.8 | 53.34,0.66 JP21.6 | JP21.4 48.26,0.68 48.24,0.66 | JP21.2 43.18,0.7 43.14,0.66 | v28.04,7.36 v33.29,7.36 | 19.99,43.27 20.15,43.27 20.32,43.43 21.46,43.43 | 23.41,40.61 23.27,40.61 22.61,41.27 22.61,43.05 22.22,43.43 21.46,43.43 | 21.46,43.43 C13.2
  Top 0.61: JP10.2 24.29,40.48 24.29,36.11 22.19,34.01 22.19,33.74 | 58.42,14.26 58.42,14.99 JP27.2 | 58.42,14.26 58.42,14.11 C11.2 | L1.1 54.36,13.42 JP27.1 | v33.29,7.36 35.54,7.36 | 58.42,14.26 58.44,14.26 v58.44,14.56 | 17.53,43.35 17.54,43.36 | 17.53,43.35 R1.2 C2.2 | U3.5 17.5,43.32 17.53,43.35 | C2.2 19.76,43.27 19.79,43.23 | 19.99,43.27 C2.2 | JP10.2 24.07,40.64 24.04,40.61 23.41,40.61 | JP10.1 24.13,43.14 26.79,40.48 29.16,40.48 29.21,40.53 JP12.1 | 25.09,31.41 C5.2 22.4,31.41 JP4.2 | 22.19,33.74 22.19,33.73 | 22.19,33.74 JP4.1
  Bottom 0.152: JP12.1 29.24,40.66 | JP12.1 | 29.16,40.59 29.18,40.59 JP12.1 | 29.54,14.73 | 29.54,14.73 | 29.54,14.73 30.52,13.76 v30.89,13.76
  Bottom 0.203: JP27.2 56.92,16.51
  Bottom 0.305: 24.13,43.15 JP10.2 | 22.19,31.2 22.19,31.18 | 22.19,31.2 JP4.2 | JP4.1 22.19,33.74 22.19,31.2
  Bottom 0.406: JP27.2 JP27.1 | 35.54,7.36 35.66,7.48 33.41,7.48 v33.29,7.36 | v28.04,7.36 28.04,13.11 29.54,14.73 29.66,14.86 30.29,15.48 30.29,17.48 30.91,18.11 30.91,20.73 31.29,21.23 31.29,38.86 29.79,40.36 29.16,40.36 29.16,40.59 | JP10.1 24.14,43.16 24.13,43.15
  Bottom 0.61: 57.04,16.61 56.94,16.51 JP27.2 | 58.44,11.36 58.44,9.46 48.41,9.46 | 58.44,11.36 v58.44,14.56 | 48.41,9.46 48.37,9.46 | v33.29,7.36 45.29,7.36 47.41,9.48 48.41,9.48 48.41,9.46 | 58.44,11.36 58.29,11.36 58.27,11.38 D2.C
  pour Top (isolate 0.254): 16.54,18.61 16.54,26.11 18.79,28.36 26.29,28.36 28.54,26.11 28.54,18.61 26.29,16.36 18.79,16.36
+5V  (via drill 0.38)
  Top 0.61: D1.A 7.55,37.98 7.54,37.98 7.57,38.01 R4.2 6.32,38.01 v5.67,37.36 | JP23.1 5.14,18.66 v7.44,16.36 | v5.66,28.96 C14.2
  Bottom 0.61: 5.67,26.36 JP1.1 | 5.67,26.36 7.54,26.36 7.79,26.61 10.04,26.61 10.1,26.67 JP17.1 10.14,26.66 11.14,26.66 12.34,25.46 12.34,17.36 11.34,16.36 v7.44,16.36 | 5.67,26.36 5.67,29.08 | 5.67,29.08 v5.67,37.36 | 5.67,29.08 5.66,29.08 v5.66,28.96
ADC0
  Top 0.152: U1.1 56.29,30.11 56.66,30.48 56.66,31.11 57.29,31.73 61.41,31.73 61.54,31.61 65.79,31.61 68.04,33.86 68.04,34.61 70.67,37.23 75.17,37.23 76.17,38.23 76.17,40.61 JP18.15
ADC1
  Top 0.152: U1.2 55.79,30.11 56.29,30.61 56.29,31.23 56.66,31.61 56.66,33.11 56.91,33.36 59.79,33.36 60.16,33.73 66.54,33.73 70.42,37.61 73.67,37.61 74.92,38.86 74.92,41.86 76.2,43.14 JP19.15
ADC2
  Top 0.152: U1.3 55.29,30.11 55.91,30.73 55.91,31.36 56.29,31.73 56.29,33.36 56.66,33.73 59.54,33.73 59.91,34.11 66.29,34.11 70.17,37.98 70.42,37.98 71.17,38.73 71.17,40.61 71.14,40.64 JP18.13
ADC3
  Top 0.152: U1.4 54.79,30.11 55.54,30.86 55.54,31.48 55.91,31.86 55.91,33.61 56.41,34.11 59.29,34.11 59.66,34.48 66.04,34.48 69.92,38.36 69.92,42.11 71.04,43.23 71.1,43.18 JP19.13
ADC4
  Top 0.152: U1.5 54.29,30.11 55.16,30.98 55.16,31.61 55.54,31.98 55.54,33.86 56.16,34.48 59.04,34.48 59.54,34.98 65.79,34.98 66.42,35.61 66.42,40.23 66.04,40.61 JP18.11
ADC5
  Top 0.152: U1.6 53.79,30.23 54.79,31.23 54.79,31.73 55.16,32.11 55.16,34.11 55.91,34.86 58.79,34.86 59.41,35.48 60.54,35.48 64.79,39.73 64.79,42.11 65.92,43.23 65.97,43.18 JP19.11
ADC6
  Top 0.152: U1.7 53.29,30.23 54.41,31.36 54.41,31.86 54.79,32.23 54.79,34.23 56.66,36.11 56.66,37.11 58.04,38.48 59.66,38.48 60.91,39.73 60.91,40.61 60.95,40.64 JP18.9
GND  (via drill 0.38)
  Top 0.203: v70.04,32.86 70.04,32.11 | U1.96 v53.74,24.76 | U2.1 16.54,26.36 16.16,26.73 16.16,26.86 16.54,27.23 | C9.1 62.06,16.63 62.66,17.23 62.66,17.86 62.74,17.93 R12.1 | U1.58 56.89,25.11 56.84,25.16 55.74,25.16 | 55.74,25.16 55.69,25.16 | U1.77 55.74,25.16
  Top 2.997: ANT1.GND 70.55,32.1 70.54,32.11 70.04,32.11
  other vias: 64.79,27.86 66.54,27.86 70.04,27.86 68.29,27.86 61.54,27.86 70.04,29.36 70.04,31.11 70.04,34.86 71.29,36.11 73.04,36.11 74.79,36.11 76.54,36.11 78.29,36.11 80.04,36.11 70.04,24.36 70.04,22.61 70.04,17.36 70.04,15.61 70.04,9.61 68.29,24.36 66.54,24.36 64.79,24.36 62.91,13.23 80.42,6.23 56.54,14.11 16.54,15.36 44.91,9.23 48.29,14.73 44.54,14.48 30.16,19.86 14.79,20.73 14.91,24.48 13.79,28.48 12.04,39.61 12.04,37.86 22.05,40.35 11.66,41.61 9.16,40.61 25.21,34.46 30.41,25.61 24.66,30.11 16.29,26.98 14.16,18.36 22.79,14.61 34.29,31.75 34.29,34.29 34.29,29.21 2.54,12.7 7.62,12.7 12.7,12.7 17.78,12.7 22.86,12.7 25.4,10.16 25.4,7.62 27.94,5.08 27.94,2.54 33.02,5.08 54.54,25.56 34.29,11.43 34.29,8.89
  pour Top (isolate 0.254, rank 6): 0,0 81.28,0 81.28,45.72 0,45.72
  pour Bottom (isolate 0.254, rank 6): 0,0 81.28,0 81.28,45.72 0,45.72
GPIO42  (via drill 0.38)
  Top 0.203: U1.56 58.04,24.11 58.29,23.86 v58.54,23.86
  Bottom 0.203: JP20.15 76.26,5.08 76.29,5.11 76.29,6.61 76.04,6.86 69.04,6.86 67.79,8.11 67.79,18.11 63.04,22.86 62.54,22.86 62.04,23.36 59.04,23.36 v58.54,23.86
GPIO43  (via drill 0.38)
  Top 0.203: v61.04,24.36 60.04,24.36 59.79,24.61 U1.57
  Bottom 0.203: v61.04,24.36 62.04,24.36 62.29,24.11 62.29,23.86 62.79,23.36 63.29,23.36 68.29,18.36 68.29,8.36 69.29,7.36 76.79,7.36 77.44,6.71 77.44,3.86 78.74,2.56 JP21.16
KBI0  (via drill 0.38)
  Top 0.152: U1.42 53.29,17.61 52.16,16.48 52.16,15.98 51.91,15.73 51.91,14.23 v51.41,13.73 | v41.54,11.86 v44.16,11.86 | S3.B2 64.05,32.49 64.04,32.48 v61.41,32.48 61.41,32.49 S3.B1
  Bottom 0.152: v61.41,32.48 58.79,35.11 46.91,35.11 45.04,33.23 43.54,33.23 42.79,32.48 42.79,29.98 43.54,29.23 43.54,24.98 41.79,23.23 41.79,20.98 40.54,19.73 40.54,12.86 v41.54,11.86 | v44.16,11.86 44.54,11.86 46.41,13.73 v51.41,13.73
KBI1  (via drill 0.38)
  Top 0.152: U1.41 52.79,17.61 51.79,16.61 51.79,16.23 51.41,15.86 51.41,15.36 v50.54,14.48 | v41.91,12.98 v44.16,12.98 | 47.03,32.49 47.04,32.48 v43.79,32.48 | 47.03,32.49 S2.B1 | 47.03,32.49 47.79,32.5 v47.79,33.73 | S2.B2 52.79,32.48 v53.54,31.43
  Bottom 0.152: v43.79,32.48 43.16,31.86 43.16,30.11 43.91,29.36 43.91,24.86 42.16,23.11 42.16,20.86 40.91,19.61 41.04,14.61 41.04,13.98 42.04,12.98 v41.91,12.98 | v44.16,12.98 44.54,12.98 45.66,14.11 50.16,14.11 v50.54,14.48 | v53.54,31.43 52.79,32.48 48.29,32.48 47.79,32.98 v47.79,33.73
KBI2
  Top 0.152: 68.74,6.36 68.04,7.06 66.04,7.06 64.84,8.26 63.04,8.26 60.02,8.26 58.54,9.73 50.16,9.73 49.66,10.23 49.66,12.48 49.79,12.61 49.79,14.86 51.29,16.36 51.29,16.61 52.29,17.61 U1.40
  Top 0.203: JP20.13 71.12,5.58 70.34,6.36 68.74,6.36
KBI3  (via drill 0.38)
  Top 0.152: U1.39 51.79,17.61 50.79,16.61 50.79,16.36 49.41,14.98 49.41,12.73 49.29,12.61 49.29,10.11 50.04,9.36 57.79,9.36 v58.54,8.61
  Bottom 0.152: 71.06,2.54 69.84,3.76 67.54,3.76 67.34,3.96 67.34,6.56 65.84,6.56 64.64,7.76 59.39,7.76 v58.54,8.61
  Bottom 0.203: 71.06,2.54 JP21.13
KBI4  (via drill 0.38)
  Top 0.152: U1.38 51.29,17.61 49.79,16.11 v49.41,16.11 49.29,16.11 | v53.66,34.23 53.66,34.36 v55.79,36.48 | v60.79,37.73 59.54,36.48 58.41,36.48 58.42,36.49 S3.A1 | S3.A2 64.24,36.81 v65.17,37.73
  Bottom 0.152: v49.41,16.11 46.54,16.11 44.41,18.23 44.41,31.98 47.16,34.73 53.16,34.73 v53.66,34.23 | v55.79,36.48 59.54,36.48 v60.79,37.73 v65.17,37.73
KBI5  (via drill 0.38)
  Top 0.152: U1.37 50.79,17.73 49.91,16.86 v48.16,16.86 | 47.91,36.11 47.54,36.48 47.29,36.48 47.16,36.61 45.91,36.61 45.66,36.36 | v52.29,33.98 52.29,36.48 52.41,36.48 | S2.A1 v43.41,36.48 | v43.41,38.73 48.79,38.73 51.04,36.48 52.41,36.48 | 52.41,36.48 S2.A2
  Top 0.406: S2.A1 47.05,36.49 47.16,36.61
  Bottom 0.152: v48.16,16.86 46.79,16.86 44.79,18.86 44.79,30.23 44.91,30.36 44.91,31.86 47.41,34.36 51.91,34.36 v52.29,33.98 | v43.41,38.73 v43.41,36.48
KBI6
  Top 0.152: 68.58,2.62 67.34,3.86 67.34,6.56 65.84,6.56 64.64,7.76 58.27,7.76 57.04,8.98 49.79,8.98 48.91,9.86 48.91,12.61 47.79,13.73 46.16,13.73 46.04,13.86 46.04,17.11 46.54,17.61 49.91,17.61 50.29,17.98 U1.36
  Top 0.203: 68.58,2.62 JP21.12
KBI7  (via drill 0.38)
  Top 0.152: U1.35 49.79,18.36 49.66,18.36 v49.54,18.23 | v60.04,18.36 58.54,18.36 v57.66,19.23
  Bottom 0.152: 68.58,6.52 68.04,7.06 66.04,7.06 64.84,8.26 60.02,8.26 59.41,8.86 59.41,16.61 60.04,17.23 v60.04,18.36 | v57.66,19.23 49.79,19.23 49.79,18.48 49.54,18.36 v49.54,18.23 49.66,18.23 49.79,18.36
  Bottom 0.203: 68.58,6.52 JP20.12
MISO  (via drill 0.38)
  Top 0.152: U1.29 45.41,22.11 44.66,21.36 43.29,21.36 42.79,20.86 v42.79,20.23 | v39.16,6.36 v39.16,9.11
  Bottom 0.152: v42.79,20.23 42.79,13.98 42.66,13.86 42.66,11.61 42.16,11.11 41.04,11.11 39.16,9.23 v39.16,9.11 | JP20.7 54.23,6.73 39.16,6.73 v39.16,6.36
MOSI  (via drill 0.38)
  Top 0.152: U1.28 45.04,22.61 44.16,21.73 43.16,21.73 41.29,19.86 41.29,15.48 39.79,13.98 32.77,13.98 30.06,11.29 v29.54,11.29
  Bottom 0.152: JP21.5 50.8,1.12 50.16,0.48 32.91,0.48 29.54,3.86 29.54,10.73 | 29.54,10.73 29.54,10.79 | 29.54,10.73 v29.54,11.29
N$1
  Top 0.152: U3.3 14.22,41.42 14.29,41.48 14.29,42.73 13.79,43.23 13.04,43.23 13.02,43.22 U3.1
  Top 0.61: U3.1 10.56,43.22 10.54,43.23
  Top 1.016: JP13.1 4.49,43.18 4.54,43.23 7.67,43.23 | C1.2 10.51,43.27 10.54,43.23 7.67,43.23 | 7.67,43.23 7.67,43.11 7.62,43.06 D1.C
N$2
  Top 0.61: R1.1 17.83,41.57 18.79,40.61 18.79,39.73 18.88,39.64 R2.2 21.28,39.62 22.79,38.11 22.79,36.61 22.82,36.58 JP11.1
N$3
  Top 0.61: 15.4,39.62 15.41,39.61 | C3.2 15.4,39.62 | U3.4 15.38,39.65 15.4,39.62 | C3.2 17.15,39.62 17.16,39.61 R2.1 17.18,39.5 17.16,39.48 17.16,37.98 18.57,36.58 JP11.2 | C3.2 15.3,39.62 15.29,39.61 15.33,39.57 R3.2
N$4
  Top 0.203: U2.6 14.91,23.61 14.66,23.86 14.04,23.86 13.64,24.26 R5.1
N$5
  Top 0.203: U2.2 15.29,25.61 15.16,25.73 15.04,25.73 14.91,25.86 14.91,26.73 16.54,28.36 16.54,29.36 16.6,29.42 C6.2 16.6,31.92 17.54,32.86 17.53,32.87 Q1.2
N$6
  Top 0.152: U2.33 29.71,18.61 29.99,18.34 29.99,16.23 29.83,16.23 R6.2
N$7
  Top 0.203: U2.3 15.29,25.11 15.16,25.23 14.79,25.23 14.41,25.61 14.41,26.61 12.91,28.11 12.04,28.11 11.04,29.11 11.09,29.16 C7.2 11.09,31.06 9.16,32.98 7.92,32.98 Q1.1
N$8
  Top 0.203: 14.32,22.36 14.54,22.36 14.79,22.61 U2.8
  Top 0.305: 10.16,21.61 JP17.3 | 10.14,21.56 10.14,21.57 JP17.3 | 10.14,22.36 14.32,22.36 | JP17.3 10.14,21.61 10.14,22.36 | JP23.3 5.6,23.86 6.1,23.37 7.11,23.37 8,22.35 10.16,22.35 10.15,22.36 10.14,22.36
  Bottom 0.305: 10.16,21.61 JP17.3 | JP17.3 10.14,21.61 10.14,22.36 | JP1.3 5.7,21.86 5.97,21.59 7.24,21.59 8,22.35 10.16,22.35 JP17.3
N$9  (via drill 0.38)
  Top 0.203: 14.19,23.36 14.54,23.36 14.79,23.11 U2.7
  Top 0.305: JP17.2 10.16,24.11 | 10.14,24.16 10.14,24.15 JP17.2 | 14.19,23.36 10.14,23.36 10.14,24.11 JP17.2 | JP23.2 5.6,21.86 6.1,22.35 v6.86,22.35
  Bottom 0.305: 10.16,24.11 JP17.2 10.14,24.15 | JP1.2 5.64,23.36 7.87,23.36 | 7.87,23.36 10.14,23.36 10.14,24.15 | 10.14,24.15 10.14,24.16 | 7.87,23.36 7.87,23.37 v6.86,22.35
N$10
  Top 0.152: R10.2 24.41,12.19 24.29,12.31 U2.28
N$11
  Top 0.203: R12.2 62.74,19.68 62.79,19.73 62.74,19.79 Q4.C
N$12
  Top 0.203: U1.60 58.79,26.11
  Top 0.406: 58.79,26.11 L2.1
N$13  (via drill 0.38)
  Top 0.152: U1.49 57.69,20.61 v59.19,19.23 | v65.29,16.48 66.29,15.48 66.29,12.86 66.34,12.86 | C16.2 70.34,11.07 66.43,11.07 66.34,11.16
  Top 0.203: Q2.1 66.29,11.21 66.34,11.16 66.34,12.86
  Bottom 0.152: v59.19,19.23 62.54,19.23 v65.29,16.48
N$14  (via drill 0.38)
  Top 0.152: U1.50 57.89,21.11 58.77,20.36 v59.54,20.36 | v64.54,18.73 66.29,18.73 | C15.2 70.34,20.93 Q2.2
  Top 0.203: 66.29,18.73 66.29,20.36 66.24,19.86 66.24,20.86 66.29,20.91 Q2.2
  Bottom 0.152: v59.54,20.36 62.91,20.36 v64.54,18.73
N$15
  Top 1.016: L2.2 C8.1 71.29,26.11 | 71.29,26.11 71.28,26.1 ANT1.FEED | 71.29,26.11 76.29,26.11
N$16
  Top 0.203: 60.29,16.58 60.29,16.61 | 60.29,16.58 C9.2 59.39,16.51 57.54,18.36 56.79,18.36 56.29,18.86 U1.48 | JP26.1 60.29,15.4 60.29,16.58
N$17
  Top 0.203: C10.2 60.62,11.19 61.29,11.86 | U1.47 55.79,18.36 56.29,17.86 57.29,17.86 58.04,17.11 58.04,16.36 59.29,15.11 59.29,13.36 60.54,12.11 61.04,12.11 61.29,11.86 | 61.29,11.86 JP26.2
N$18
  Top 0.152: U2.40 29.74,22.11 30.49,22.86 R13.2
N$19  (via drill 0.38)
  Top 0.203: 53.79,19.61 53.82,19.86 | 53.79,19.61 U1.43 | 53.79,19.61 53.79,17.61 52.59,16.41 52.59,14.96 52.58,14.96
  Top 0.61: 52.58,15.49 52.58,14.96 52.58,13.16 L1.2 50.97,11.43 51.04,11.36 v52.54,11.36
  Bottom 0.61: D2.A 52.56,11.38 v52.54,11.36
N$20
  Top 0.203: Q3.C 60.71,20.82 61.16,20.36 61.16,19.61 R11.2
RTCK  (via drill 0.38)
  Top 0.152: U1.8 52.79,31.48 52.66,31.61 51.41,31.61 51.04,31.98 51.04,35.48 48.79,37.73 41.91,37.73 41.16,38.48 v41.16,38.73 | U2.22 21.29,17.73 21.91,18.36 v21.91,19.73 | v29.66,35.61 38.04,35.61 JP2.1 | JP2.1 38.14,35.51 | 38.21,35.67 38.21,35.69 | 38.21,35.67 JP2.1 | JP2.1 38.21,35.66 38.21,35.67
  Bottom 0.152: 38.15,35.61 38.16,35.61 38.16,35.73 v41.16,38.73 | v21.91,19.73 21.91,20.48 25.91,24.48 27.04,24.48 29.41,26.86 29.41,31.11 30.54,32.23 30.54,34.73 v29.66,35.61 | JP2.1 38.17,35.48 38.19,35.48 38.12,35.56
  Bottom 0.406: 38.12,35.56 38.16,35.61
RTS_FT_OUT  (via drill 0.38)
  Top 0.152: v42.04,28.11 U1.17 | R13.1 34.08,23.96 37.02,23.96 38.1,22.88 JP3.1
  Bottom 0.152: v42.04,28.11 41.04,28.11 39.79,26.86 39.79,24.61 38.16,22.98 38.16,22.93 JP3.1
RX_ON  (via drill 0.38)
  Top 0.152: Q4.A 62.74,24.06 v63.04,24.36
  Top 0.203: U1.59 58.54,25.61 59.04,25.11 61.54,25.11 61.79,24.86 62.54,24.86 v63.04,24.36 | v69.79,8.11 70.29,7.61 77.79,7.61 78.79,6.61 78.79,5.11 78.76,5.08 JP20.16
  Bottom 0.203: v63.04,24.36 68.79,18.61 68.79,9.11 v69.79,8.11
RXD_FT_IN  (via drill 0.38)
  Top 0.152: U1.20 42.79,26.61 41.79,25.61 v41.79,25.36 | U2.39 29.79,21.61 31.04,20.36 31.04,19.73 32.99,17.78 JP2.8 | JP2.8 38.14,17.81 38.14,17.82 | 38.14,17.82 38.14,17.84 | JP2.8 38.14,17.82
  Bottom 0.152: v41.79,25.36 40.66,24.23 40.66,21.86 39.41,20.61 39.41,17.86 38.16,17.86 | 38.16,17.86 38.16,17.84 | 38.16,17.86 38.16,17.84 JP2.8
SCK  (via drill 0.38)
  Top 0.152: U1.27 44.91,23.11 43.91,22.11 43.04,22.11 40.54,19.61 40.54,18.63 38.59,16.68 32.24,16.68 v31.54,17.38
  Bottom 0.152: JP20.5 50.8,4.87 49.54,3.61 49.54,0.86 33.04,0.86 29.91,3.98 29.91,8.61 31.54,10.23 v31.54,17.38
SCL
  Top 0.152: JP19.3 44.52,41.98 39.79,41.98 39.29,41.48 39.29,40.36 38.16,39.23 38.16,38.11 38.66,37.61 39.16,37.61 39.54,37.23 39.54,25.86 41.29,24.11 42.79,24.11 44.29,25.61 46.16,25.61 | 46.16,25.61 U1.22 | 46.16,25.61 46.04,25.61
SDA
  Top 0.152: JP18.3 44.56,39.48 39.04,39.48 38.54,38.98 38.54,38.36 38.91,37.98 39.41,37.98 39.91,37.48 39.91,26.23 41.54,24.61 42.54,24.61 44.04,26.11 46.16,26.11 | 47.91,26.11 U1.21 46.16,26.11 | 46.16,26.11 46.04,26.11
SRST  (via drill 0.38)
  Top 0.152: 38.09,10.11 27.29,10.11 26.11,11.29 R10.1 | JP2.11 38.07,10.13 38.06,10.13 | 42.91,9.73 42.88,9.7 S1.B2 42.83,9.82 42.79,9.86 41.91,9.86 40.41,11.36 40.41,12.86 42.83,15.27 S1.B1 42.83,15.52 43.15,15.85 v44.29,15.85
  Top 0.203: U1.51 58.79,21.61 v59.04,21.36 | JP2.11 38.09,10.11 38.09,8.11 R9.1
  Bottom 0.152: v59.04,21.36 58.79,21.61 58.41,21.61 58.41,16.23 57.54,15.36 44.84,15.36 44.32,15.88 v44.29,15.85 44.28,15.83 | JP2.11 38.12,10.14 38.12,10.13 38.06,10.13 38.04,10.16 38.04,8.61 38.16,8.48 41.29,8.48 43.54,10.73 43.54,13.36 43.74,13.56 43.74,15.16 44.31,15.73 44.31,15.86 44.29,15.83 44.28,15.83 | 44.28,15.83 44.27,15.83
SS  (via drill 0.38)
  Top 0.152: U1.30 45.79,21.61 44.79,20.61 v43.79,20.61 | v40.41,9.23 40.41,8.48 41.91,6.98 47.79,6.98 48.41,6.36 49.91,6.36 50.91,7.36 56.16,7.36 57.16,6.36 57.16,3.73 55.97,2.54 JP21.7
  Bottom 0.152: v43.79,20.61 43.79,17.61 43.29,17.11 43.29,13.86 43.04,13.61 43.04,11.36 42.29,10.61 41.79,10.61 v40.41,9.23
SSI_BTCK
  Top 0.152: U1.31 46.29,21.11 44.66,19.48 42.16,19.48 41.66,18.98 41.66,15.36 39.29,12.98 39.29,11.36 41.54,9.11 41.54,7.98 42.04,7.48 47.91,7.48 48.66,6.73 49.66,6.73 50.79,7.86 56.29,7.86 57.79,6.36 59.91,6.36 60.96,5.31 JP20.9
SSI_FSYN
  Top 0.152: U1.32 46.66,20.61 45.16,19.11 42.29,19.11 42.04,18.86 42.04,15.11 39.66,12.73 39.66,11.48 41.91,9.23 41.91,8.23 42.29,7.86 48.16,7.86 48.91,7.11 49.54,7.11 50.66,8.23 56.54,8.23 58.04,6.73 61.54,6.73 62.16,6.11 62.16,3.73 JP21.9
SSI_RX
  Top 0.152: 66.04,5.66 64.44,7.26 58.14,7.26 56.79,8.61 50.54,8.61 49.54,7.61 49.04,7.61 48.16,8.48 48.16,12.23 47.41,12.98 45.91,12.98 45.29,13.61 45.29,17.36 46.66,18.73 48.41,18.73 48.79,19.11 U1.33
  Top 0.203: 66.04,5.66 JP20.11
SSI_TX  (via drill 0.38)
  Top 0.152: U1.34 49.29,18.98 48.66,18.36 46.79,18.36 45.66,17.23 45.66,13.73 46.04,13.36 47.66,13.36 48.54,12.48 48.54,9.11 v49.29,8.36
  Bottom 0.152: 66.04,2.56 64.74,3.86 64.74,6.96 | 64.44,7.26 58.74,7.26 57.64,8.36 v49.29,8.36
  Bottom 0.203: 66.04,2.56 JP21.11 | 64.44,7.26 64.74,6.96
TCK  (via drill 0.38)
  Top 0.152: U1.11 51.29,30.23 49.91,31.61 49.91,34.86 49.54,35.23 41.79,35.23 v41.16,34.61 | U2.16 15.16,18.61 15.04,18.48 v15.04,16.98 | v27.91,29.73 30.91,29.73 32.66,27.98 37.96,27.98 38.02,27.93 JP2.4
  Bottom 0.152: v41.16,34.61 40.29,33.73 40.29,30.86 39.04,29.61 39.04,27.98 38.04,27.98 | v15.04,16.98 16.91,16.98 18.29,18.36 18.29,18.73 25.16,25.61 26.66,25.61 27.04,25.98 27.04,28.86 v27.91,29.73 | 38.08,27.93 JP2.4 | 38.08,27.93 38.09,27.94 | 38.08,27.93 38.04,27.93
  Bottom 0.406: 38.09,27.94 38.04,27.98 37.99,27.94
TDI  (via drill 0.38)
  Top 0.152: U1.10 51.79,30.73 51.66,30.86 51.16,30.86 50.29,31.73 50.29,35.11 49.79,35.61 41.66,35.61 v41.16,36.11 | v18.79,14.23 U2.17 | 38.1,30.5 38.09,30.51 38.06,30.48 38.02,30.48 | v30.29,30.48 38.02,30.48 | JP2.3 38.14,30.44 38.14,30.43 38.12,30.46 38.02,30.46 38.02,30.48
  Bottom 0.152: 38.05,30.48 38.04,30.48 JP2.3 | v41.16,36.11 41.04,36.11 39.91,34.98 39.91,31.61 38.79,30.48 38.16,30.48 JP2.3 | v18.79,14.23 20.29,14.23 22.79,16.73 22.79,20.73 26.16,24.11 27.16,24.11 30.29,27.23 v30.29,30.48 | JP2.3
  Bottom 0.406: 38.16,30.48
TDO  (via drill 0.38)
  Top 0.152: U1.9 52.29,30.98 52.04,31.23 51.29,31.23 50.66,31.86 50.66,35.36 48.66,37.36 v41.16,37.36 | U2.18 v19.29,18.61 | v29.66,32.98 37.56,32.98 37.59,33.01 JP2.2 | JP2.2 38.16,33.01 | JP2.2
  Bottom 0.152: v41.16,37.36 39.54,35.73 39.54,33.73 38.79,32.98 38.16,32.98 38.13,32.98 | v19.29,18.61 19.29,19.11 25.41,25.23 26.79,25.23 27.41,25.86 27.41,28.48 27.79,28.86 28.04,28.86 28.66,29.48 28.66,31.98 v29.66,32.98 | JP2.2 38.13,32.98 | 38.13,32.98 38.16,32.96 38.19,32.96
  Bottom 0.406: 38.16,32.98 38.13,33.02
TMR0  (via drill 0.38)
  Top 0.152: U1.26 44.79,23.61 43.66,22.48 42.91,22.48 39.54,19.11 32.79,19.11 v31.79,20.11
  Bottom 0.152: JP21.3 45.72,1.29 45.66,1.23 33.16,1.23 30.29,4.11 30.29,8.48 32.29,10.48 32.29,19.61 v31.79,20.11
TMR1  (via drill 0.38)
  Top 0.152: U1.25 44.66,24.11 43.41,22.86 42.66,22.86 41.41,21.61 v32.66,21.61
  Bottom 0.152: JP20.3 45.72,4.91 44.41,3.61 40.16,3.61 38.54,1.98 33.41,1.98 31.04,4.36 31.04,7.98 33.04,9.98 33.04,21.23 v32.66,21.61
TMR2  (via drill 0.38)
  Top 0.152: U1.24 44.54,24.61 43.16,23.23 39.81,23.23 39.59,23.23 38.52,24.31 32.87,24.31 v32.66,24.11
  Bottom 0.152: JP21.1 39.72,2.54 38.79,1.61 33.29,1.61 30.66,4.23 30.66,8.23 32.66,10.23 32.66,20.48 31.91,21.23 31.91,23.36 v32.66,24.11
TMR3  (via drill 0.38)
  Top 0.152: U1.23 44.41,25.11 43.04,23.73 41.04,23.73 39.16,25.61 39.16,25.86 38.41,26.61 v33.41,26.61
  Bottom 0.152: JP20.1 40.64,4.71 38.29,2.36 33.54,2.36 31.41,4.48 31.41,7.73 33.41,9.73 v33.41,26.61
TMS  (via drill 0.38)
  Top 0.152: U1.12 50.79,30.23 49.54,31.48 49.54,34.48 49.16,34.86 42.91,34.86 41.79,33.73 v41.79,33.48 | U2.19 19.79,17.86 v20.54,18.61 | v28.54,28.23 30.29,28.23 33.16,25.36 38.09,25.36 JP2.5
  Bottom 0.152: v41.79,33.48 41.79,33.36 40.66,32.23 40.66,30.61 39.41,29.36 39.41,25.98 38.79,25.36 38.09,25.36 JP2.5 | v20.54,18.61 20.54,19.73 25.66,24.86 26.91,24.86 27.79,25.73 27.79,27.48 v28.54,28.23
TX_ON  (via drill 0.38)
  Top 0.152: Q3.A 60.71,22.65 60.66,22.61 v58.54,22.61
  Top 0.203: U1.52 57.99,22.11 v58.54,22.61 | JP21.15 76.11,2.54 74.94,3.71 74.94,6.86 69.04,6.86 68.04,7.86 v66.29,7.86
  Bottom 0.203: v58.54,22.61 62.04,22.61 62.29,22.36 62.79,22.36 67.29,17.86 67.29,9.36 66.29,8.36 v66.29,7.86
TXD_FT_OUT  (via drill 0.38)
  Top 0.152: U1.19 42.79,27.11 42.41,26.73 v41.79,26.73 | v30.46,21.86 31.29,21.86 32.81,20.34 38.09,20.34 JP2.7 | v25.16,21.48 26.79,21.48 27.16,21.11 U2.38
  Bottom 0.152: v41.79,26.73 40.16,25.11 40.16,22.11 38.39,20.34 38.09,20.34 | v30.46,21.86 26.41,21.86 26.04,21.48 v25.16,21.48 | 38.09,20.34 38.06,20.34 | JP2.7 38.09,20.34
UART1_CTS  (via drill 0.38)
  Top 0.152: v39.29,38.73 40.29,37.73 40.29,28.73 41.66,27.36 42.41,27.36 42.66,27.61 U1.18 47.91,27.61 | U2.41 29.59,22.61 30.35,23.37 30.35,23.5 v32.13,25.27
  Bottom 0.152: JP19.5 49.6,41.98 39.79,41.98 39.29,41.48 v39.29,38.73 | v32.13,25.27 32.13,36.58 34.29,38.73 v39.29,38.73 | v39.29,38.73 39.37,38.73
UART2_CTS  (via drill 0.38)
  Top 0.152: U1.14 49.79,29.98 48.16,31.61 43.41,31.61 43.04,31.98 43.04,32.73 43.54,33.23 44.29,33.23 44.79,33.73 v44.79,33.98
  Bottom 0.152: v44.79,33.98 46.29,35.48 52.79,35.48 55.91,38.61 55.91,40.61 | 55.91,40.61 JP18.7 55.91,40.61
UART2_RTS  (via drill 0.38)
  Top 0.152: U1.13 50.29,30.11 49.16,31.23 49.16,33.23 49.04,33.23 v48.79,33.73
  Bottom 0.152: JP19.9 60.91,43.22 60.91,43.23 59.66,41.98 57.29,41.98 57.16,41.86 57.16,39.23 54.79,36.86 54.79,36.11 55.16,35.73 59.41,35.73 62.16,32.98 62.16,32.11 61.79,31.73 54.41,31.73 52.91,33.23 49.04,33.23 v48.79,33.73
UART2_RX  (via drill 0.38)
  Top 0.152: U1.15 49.29,29.86 47.91,31.23 43.16,31.23 42.66,31.73 42.66,32.98 43.41,33.73 v43.41,33.98
  Bottom 0.152: v43.41,33.98 45.29,35.86 50.66,35.86 54.66,39.86 54.66,41.98 55.86,43.18 JP19.7
UART2_TX  (via drill 0.38)
  Top 0.152: U1.16 48.79,29.73 47.66,30.86 42.79,30.86 v41.91,31.73
  Bottom 0.152: v41.91,31.73 41.91,32.48 42.66,33.23 42.66,33.86 42.54,33.98 42.54,34.48 42.91,34.86 43.66,34.86 45.04,36.23 48.04,36.23 50.79,38.98 50.79,40.61 50.8,40.62 JP18.5
VREF1H
  Top 0.152: U1.63 57.91,27.61 58.54,28.23 58.54,29.48 59.16,30.11 59.16,30.86 59.66,31.36 61.29,31.36 61.41,31.23 66.04,31.23 68.42,33.61 68.42,34.48 70.79,36.86 76.67,36.86 79.92,40.11 79.92,42.11 78.79,43.23 JP19.16
VREF1L  (via drill 0.38)
  Top 0.152: U1.62 58.16,27.11 v59.29,28.23
  Bottom 0.152: v59.29,28.23 60.16,29.61 64.42,29.61 68.42,33.61 68.42,34.48 70.79,36.86 76.67,36.86 78.79,38.98 78.79,40.61 78.76,40.64 JP18.16
VREF2H  (via drill 0.38)
  Top 0.152: U1.64 57.66,28.11 58.04,28.48 v58.04,30.11 | v46.04,28.98 43.04,28.98 42.54,29.48 v41.91,29.48 | 28.09,16.27 28.09,16.31 | 28.09,16.27 R6.1 | 28.09,16.27 28.09,14.49 R8.1 28.11,11.31 28.89,10.54 35.91,10.54 JP15.1
  Bottom 0.152: v58.04,30.11 47.16,30.11 v46.04,28.98 | v41.91,29.48 42.66,29.48 43.16,28.98 43.16,25.23 41.41,23.48 41.41,21.11 40.16,19.86 40.16,14.81 38.06,12.71 38.07,12.7 JP15.1
VREF2L  (via drill 0.38)
  Top 0.152: U1.61 58.54,26.61 59.41,27.48 59.91,27.48 60.41,27.98 60.41,29.23 | 60.41,29.23 R7.2 | v60.41,30.61 60.41,29.23 | v45.54,29.98 42.66,29.98 v41.91,30.73 | 28.41,19.11 U2.34 30.16,19.11 30.77,18.51 30.77,17.13 31.56,16.34 37.02,16.34 JP16.1 | JP16.1 38.12,15.23 | JP16.1
  Bottom 0.152: v60.41,30.61 60.16,30.86 57.66,30.86 57.29,30.48 45.91,30.48 45.54,30.11 v45.54,29.98 | v41.91,30.73 41.66,30.73 41.04,30.11 41.04,29.23 41.41,28.86 42.54,28.86 42.79,28.61 42.79,25.48 41.04,23.73 41.04,21.36 39.79,20.11 39.79,16.48 38.56,15.26 38.12,15.26 38.12,15.25 JP16.1

### Text on the board
tPlace: + | SHORT | VBATT_IN | Vbat | Vbat | SCL | Vbat | U1CTS | Vbat | U2RX | Vbat | U2RTS | Vbat | ADC5 | Vbat | ADC3 | Vbat | ADC1 | VREF1H | to PWR VBATT | + - | 3v6 MAX | UNREGULATED | G | G | SDA | ADC4 | - + | G | U2TX | G | U2CTS | G | ADC6 | G | G | ADC2 | G | ADC0 | VREF1L | OPEN: | SHORT: | Vbat=3v29 | RTCK | Vbat=3v55 | SHORT | to PWR | TDO | KBI0-4 | VBATT_IN | 16V MAX | REGULATED | JTAG | KBI1-5 | TDI | TCK | TMS | D- | U1RTS | D+ | U1RX | U1TX | RESET | VREF2L | SRST | VREF2H | TMR3 | G | RedBee - EconoTAG r2 | TMR1 | G | SCK | G | MISO | G | BTCK | G | SSIRX | KBI7 | KBI2 | G | IO42 | RXON | http://mc1322x.devl.org | http://www.redwirellc.com | TMR2 | Vbat | TMR0 | Vbat | MOSI | Vbat | SS | Vbat | FSYN | Vbat | SSITX | KBI6 | KBI3 | Vbat | TXON | IO43
bPlace: JP10 | CUT to use VBAT only | RTCK | TDO | TDI | CUT to disconnect JTAG | TCK | TMS | U1RTS | CUT to use | buck inductor | U1RX | JP27 | U1TX | VREF2L | VREF2H | SRST
_tplace: + | SHORT | VBATT_IN | Vbat | Vbat | SCL | Vbat | U1CTS | Vbat | U2RX | Vbat | U2RTS | Vbat | ADC5 | Vbat | ADC3 | Vbat | ADC1 | VREF1H | to PWR VBATT | + - | 3v6 MAX | UNREGULATED | G | G | SDA | ADC4 | - + | S2 | G | U2TX | G | U2CTS | G | ADC6 | G | G | ADC2 | G | ADC0 | VREF1L | OPEN: | S3 | SHORT: | Vbat=3v29 | RTCK | Vbat=3v55 | SHORT | to PWR | TDO | KBI0-4 | VBATT_IN | 16V MAX | REGULATED | JTAG | KBI1-5 | TDI | TCK | 1 | TMS | D- | U1RTS | D+ | U1RX | 4 | U1TX | RESET | VREF2L | JP23 | S1 | SRST | VREF2H | TMR3 | G | RedBee - EconoTAG r2 | TMR1 | G | SCK | G | MISO | G | BTCK | G | SSIRX | KBI7 | KBI2 | G | IO42 | RXON | http://mc1322x.devl.org | http://www.redwirellc.com | TMR2 | Vbat | TMR0 | Vbat | MOSI | Vbat | SS | Vbat | FSYN | Vbat | SSITX | KBI6 | KBI3 | Vbat | TXON | IO43
_bplace: JP10 | CUT to use VBAT only | RTCK | TDO | TDI | CUT to disconnect JTAG | TCK | TMS | U1RTS | CUT to use | buck inductor | U1RX | JP27 | U1TX | JP1 | VREF2L | VREF2H | SRST
_tnames: JP13 | JP10 | JP19 | D1 | C1 | U3 | JP18 | R1 | C2 | C13 | R2 | C3 | JP12 | R4 | JP11 | JP2 | Q1 | R3 | C12 | C4 | JP4 | JP4 | C5 | C6 | U1 | R7 | C7 | C14 | U2 | L2 | C8 | R11 | R5 | R13 | Q3 | Q4 | JP3 | Q2 | C15 | JP27 | R6 | C9 | JP17 | JP16 | L1 | R8 | R12 | JP15 | R10 | C16 | C10 | C11 | JP26 | R9 | JP20 | JP21
_bnames: D2